# EasyEDA Pro project ProPrj_单相逆变电路.epro

# Schematic Schematic1
Board Name: Board1; Create Date: 2025-10-31; Page Name: P1; Project Name: 单相逆变电路; Schematic Name: Schematic1; Update Date: 2025-11-13; Company: 嘉立创EDA; Page Size: A4; Version: V1.0
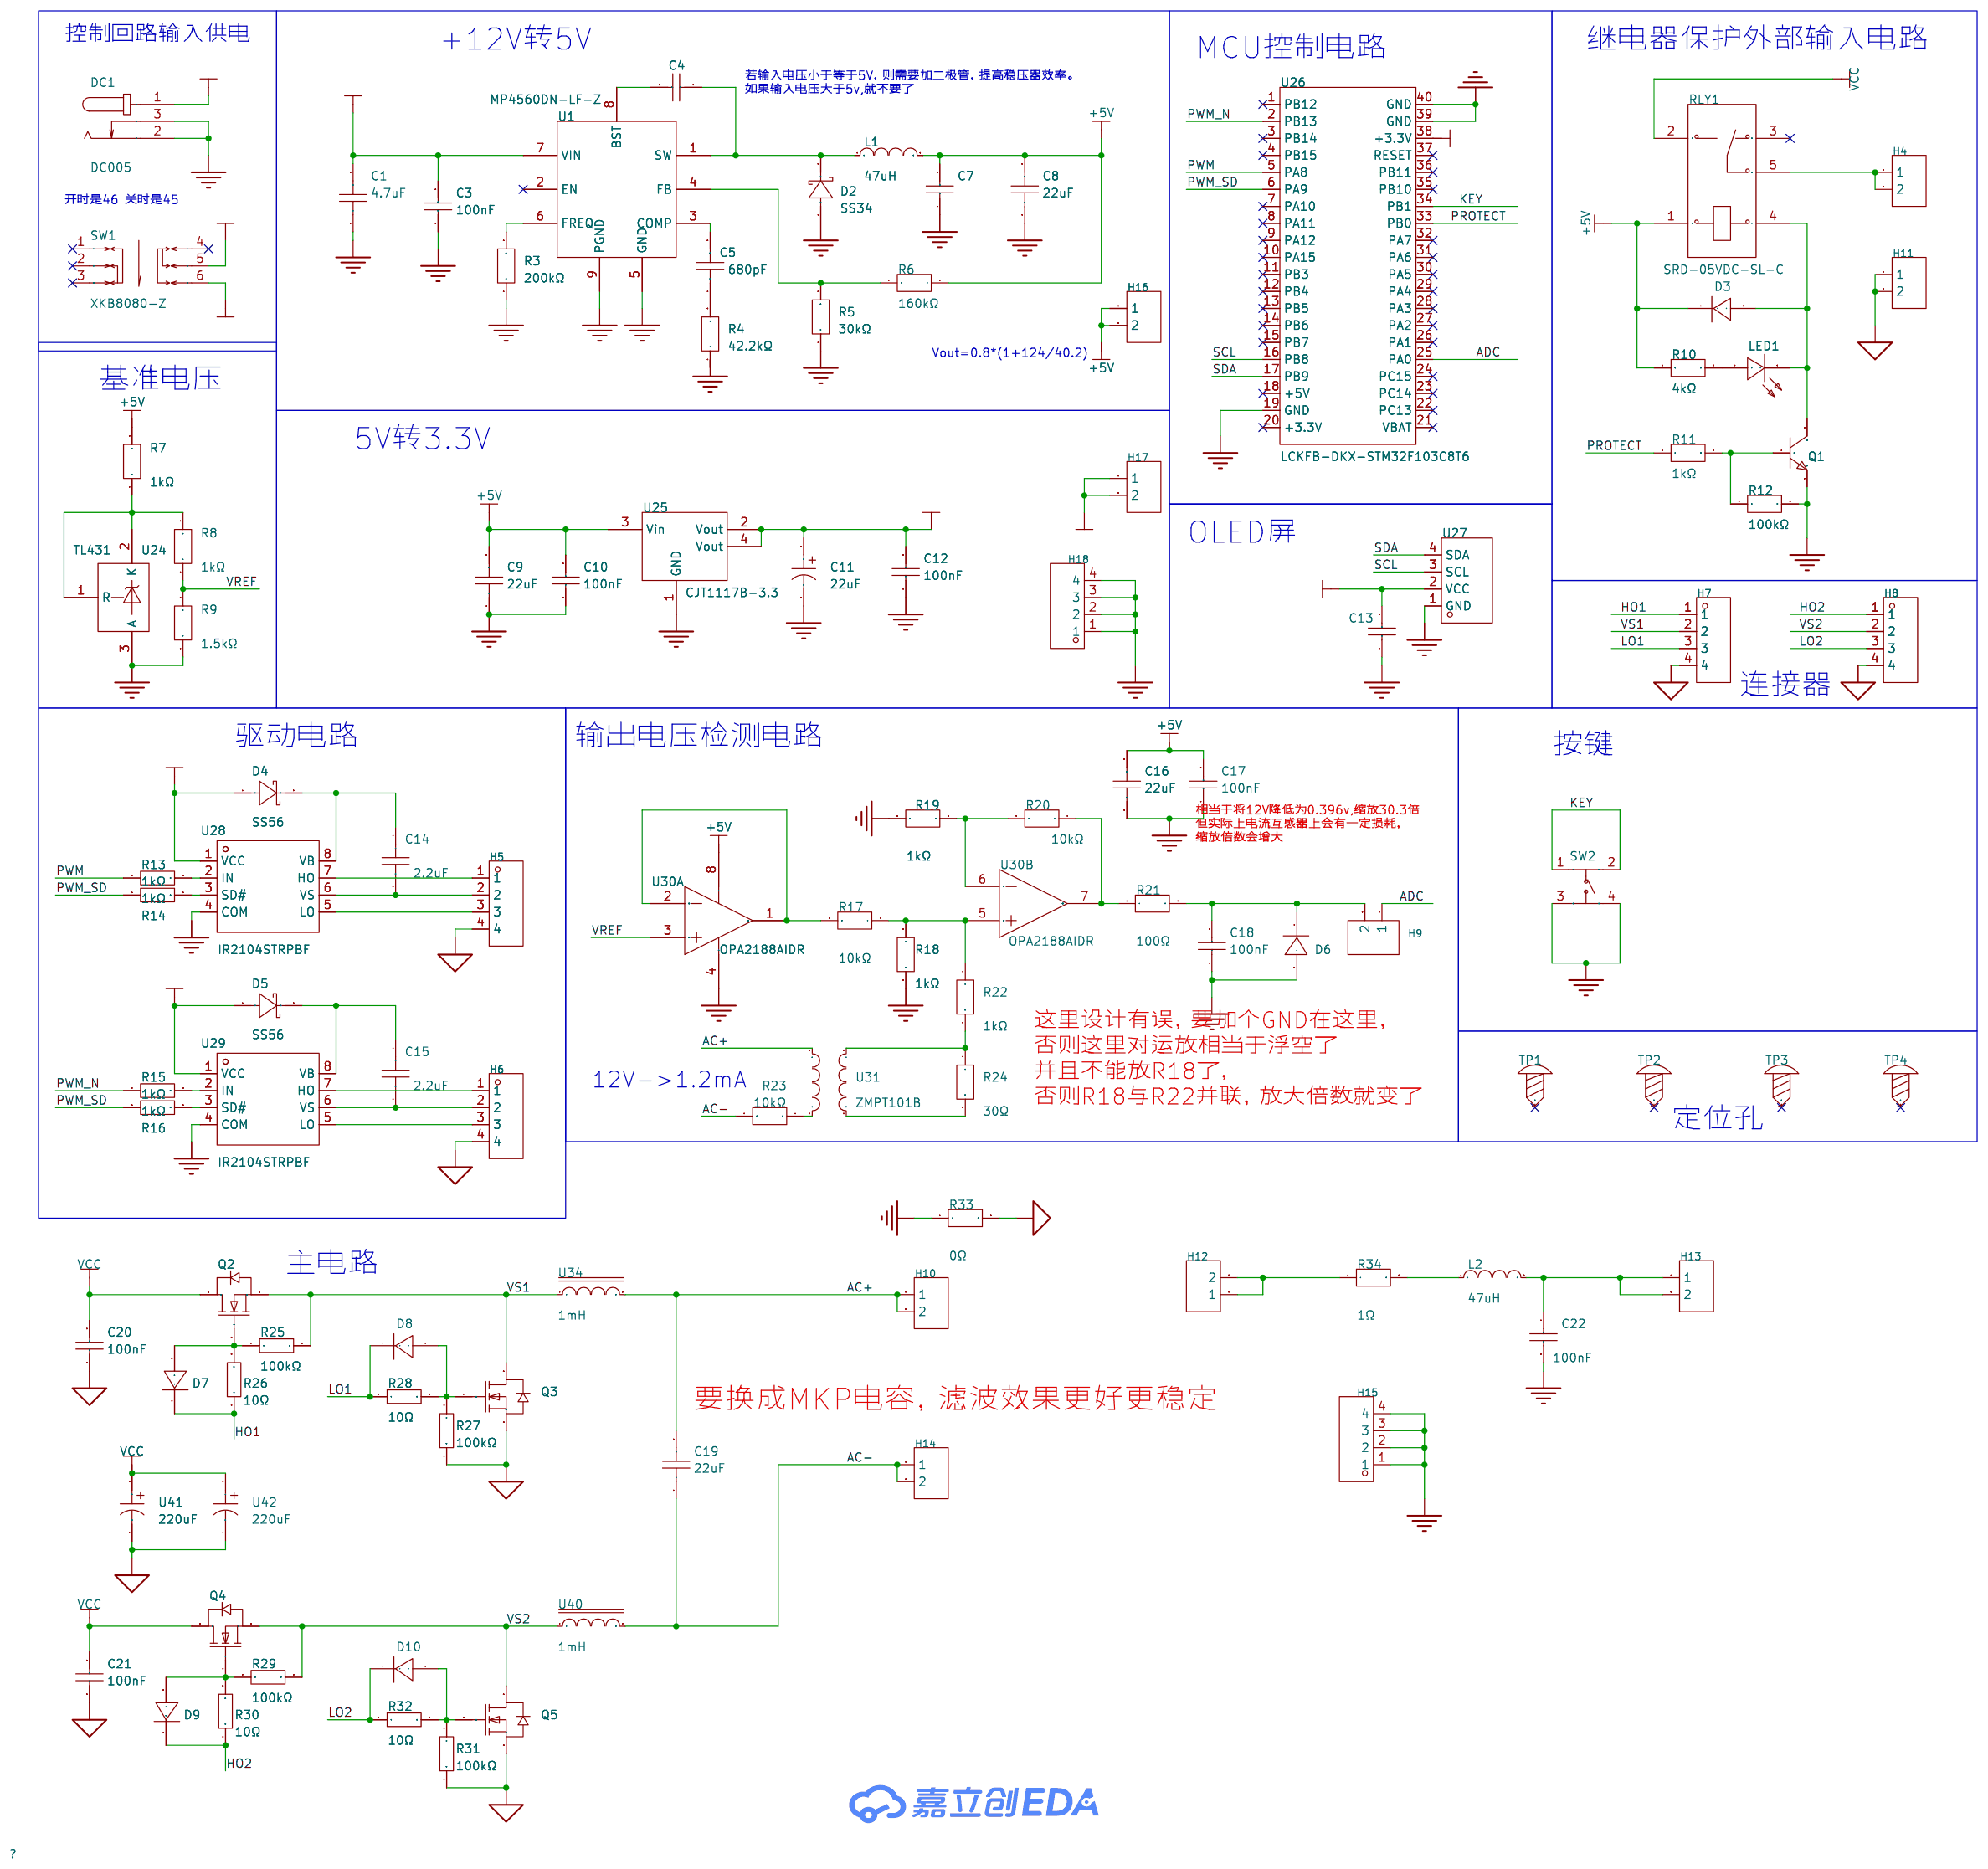
[diagram p0: schematic sheet]

## Parts
C1  4.7uF  [R1206]
C3  100nF  [C0805]
C4  100nF  [C0805]
C5  680pF  [R1206]
C7  100nF  [C0805]
C8  22uF  [C1206]
C9  22uF  [C1206]
C10  100nF  [C0805]
C11  22uF  [CAP-TH_BD6.0-P2.54-D0.5-FD]
C12  100nF  [C0805]
C13  100nF  [C0805]
C14  2.2uF  [C1206]
C15  2.2uF  [C1206]
C16  22uF  [C1206]
C17  100nF  [C0805]
C18  100nF  [C0805]
C19  22uF  [C1206]
C20  100nF  [C0805]
C21  100nF  [C0805]
C22  100nF  [C1206]
D2  SS34  [SMA_L4.3-W2.6-LS5.0-FD]
D3  1N4148W-E3-08  [SOD-123_L2.8-W1.8-LS3.7-RD]
D4  SS56  [SMA_L4.3-W2.6-LS5.0-FD]
D5  SS56  [SMA_L4.3-W2.6-LS5.0-FD]
D6  1N4148W-E3-08  [SOD-123_L2.8-W1.8-LS3.7-RD]
D7  1N4148W-E3-08  [SOD-123_L2.8-W1.8-LS3.7-RD]
D8  1N4148W-E3-08  [SOD-123_L2.8-W1.8-LS3.7-RD]
D9  1N4148W-E3-08  [SOD-123_L2.8-W1.8-LS3.7-RD]
D10  1N4148W-E3-08  [SOD-123_L2.8-W1.8-LS3.7-RD]
DC1  DC005  [DC-IN-TH_DC005]
H4  -  [HDR-TH_2P-P2.54-V-F]
H5  -  [HDR-TH_4P-P2.54-V-F]
H6  -  [HDR-TH_4P-P2.54-V-F]
H7  -  [HDR-TH_4P-P2.54-V-F]
H8  -  [HDR-TH_4P-P2.54-V-F]
H9  -  [HDR-TH_2P-P2.54-V-F]
H10  -  [HDR-TH_2P-P2.54-V-F]
H11  -  [HDR-TH_2P-P2.54-V-F]
H12  -  [HDR-TH_2P-P2.54-V-F]
H13  -  [HDR-TH_2P-P2.54-V-F]
H14  -  [HDR-TH_2P-P2.54-V-F]
H15  -  [HDR-TH_4P-P2.54-V-F]
H16  -  [HDR-TH_2P-P2.54-V-F]
H17  -  [HDR-TH_2P-P2.54-V-F]
H18  -  [HDR-TH_4P-P2.54-V-F]
L1  47uH  [IND-SMD_L7.0-W7.0_SMDRS70XX]
L2  47uH  [IND-SMD_L7.0-W7.0_SMDRS70XX]
LED1  NCD0805R1  [LED0805-R-RD]
Q1  MMS9013-H-TP  [SOT-23-3_L2.9-W1.3-P1.90-LS2.4-BR]
Q2  IRF3205ZPBF  [TO-220-3_L10.0-W4.5-P2.54-T]
Q3  IRF3205ZPBF  [TO-220-3_L10.0-W4.5-P2.54-T]
Q4  IRF3205ZPBF  [TO-220-3_L10.0-W4.5-P2.54-T]
Q5  IRF3205ZPBF  [TO-220-3_L10.0-W4.5-P2.54-T]
R3  200kΩ  [R1206]
R4  42.2kΩ  [R1206]
R5  30kΩ  [R1206]
R6  160kΩ  [R1206]
R7  1kΩ  [R1206]
R8  1kΩ  [R1206]
R9  1.5kΩ  [R1206]
R10  4kΩ  [R1206]
R11  1kΩ  [R1206]
R12  100kΩ  [R1206]
R13  1kΩ  [R1206]
R14  1kΩ  [R1206]
R15  1kΩ  [R1206]
R16  1kΩ  [R1206]
R17  10kΩ  [R1206]
R18  1kΩ  [R1206]
R19  1kΩ  [R1206]
R20  10kΩ  [R1206]
R21  100Ω  [R1206]
R22  1kΩ  [R1206]
R23  10kΩ  [R1206]
R24  30Ω  [R1206]
R25  100kΩ  [R1206]
R26  10Ω  [R1206]
R27  100kΩ  [R1206]
R28  10Ω  [R1206]
R29  100kΩ  [R1206]
R30  10Ω  [R1206]
R31  100kΩ  [R1206]
R32  10Ω  [R1206]
R33  0Ω  [R1206]
R34  1Ω  [R1206]
RLY1  SRD-05VDC-SL-C  [RELAY-TH_SRD-XXVDC-XL-C]
SW1  XKB8080-Z  [SW-TH_6P-L8.0-W8.0-P2.50]
SW2  TC-00104-050E  [SW-TH_4P-L6.0-W6.0-P4.50-LS6.5]
TP1  -  [M3螺丝]
TP2  -  [M3螺丝]
TP3  -  [M3螺丝]
TP4  -  [M3螺丝]
U1  MP4560DN-LF-Z  [SOIC-8_L4.9-W3.9-P1.27-LS6.0-BL-EP3.1-1]
U24  TL431  [SOT-23-3_L2.9-W1.4-P1.90-LS2.6-BR]
U25  CJT1117B-3.3  [SOT-223-4_L6.5-W3.5-P2.30-LS7.0-BR]
U26  LCKFB-DKX-STM32F103C8T6  [CONN-TH_L53.3-W22.9_STM32F103C8T6-CARD]
U27  HS96L03W2C03  [OLED-TH_L27.8-W27.2-P2.54_C9900033791]
U28  IR2104STRPBF  [SOIC-8_L4.9-W3.9-P1.27-LS6.0-BL]
U29  IR2104STRPBF  [SOIC-8_L4.9-W3.9-P1.27-LS6.0-BL]
U30  OPA2188AIDR  [SOIC-8_L4.9-W3.9-P1.27-LS6.0-BL]  (sections 1,2)
U31  ZMPT101B  [XFMR-TH_ZMPT101B]
U34  1mH  [IND-TH_L33.0-W15.6-P15.00-D1.5]
U40  1mH  [IND-TH_L33.0-W15.6-P15.00-D1.5]
U41  220uF  [CAP-TH_BD6.3-P2.50-D0.5-FD]
U42  220uF  [CAP-TH_BD6.3-P2.50-D0.5-FD]

## Library data of the parts
C1 = HHV1206R7475K101NSPJ: 容值:4.7uF;精度:±10%;额定电压:100V;温度系数:X7R;; LCSC Part Name: 4.7uF ±10% 100V; Supplier Part: C22367839; Manufacturer: Chinocera(华瓷); Supplier Footprint: 1206; JLCPCB Part Class: Extended Part; Datasheet: https://item.szlcsc.com/datasheet/HHV1206R7475K101NSPJ/23841144.html; Supplier: LCSC; Tolerance: ±10%; Voltage Rating: 100V; Temperature Coefficient: X7R
C3 C4 C7 C10 C12 C13 C17 C18 C20-C22 = CL21B104KCFNNNE: 容值:100nF;精度:±10%;额定电压:100V;温度系数:X7R;; LCSC Part Name: 100nF ±10% 100V; Supplier Part: C28233; Manufacturer: SAMSUNG(三星); Supplier Footprint: 0805; JLCPCB Part Class: Basic Part; Datasheet: https://item.szlcsc.com/datasheet/CL21B104KCFNNNE/28983.html; Supplier: LCSC; Tolerance: ±10%; Voltage Rating: 100V; Temperature Coefficient: X7R
C5 = HHV0805R7681K101NTHJ: 容值:680pF;精度:±10%;额定电压:100V;温度系数:X7R;; LCSC Part Name: 680pF ±10% 100V; Supplier Part: C5186814; Manufacturer: Chinocera(华瓷); Supplier Footprint: 0805; JLCPCB Part Class: Extended Part; Datasheet: https://item.szlcsc.com/datasheet/HHV0805R7681K101NTHJ/5857823.html; Supplier: LCSC; Tolerance: ±10%; Voltage Rating: 100V; Temperature Coefficient: X7R
C8 C9 C14-C16 C19 = CGA0805X5R226M350MT: 容值:22uF;精度:±20%;额定电压:35V;材质(温度系数):X5R;; LCSC Part Name: 22uF ±20% 35V; Supplier Part: C6119901; Manufacturer: HRE(芯声); Supplier Footprint: 0805; JLCPCB Part Class: Extended Part; Datasheet: https://atta.szlcsc.com/upload/public/pdf/source/20231129/D589D0CC4D260F7AC3A77E53B455CCB3.pdf; Supplier: LCSC; Tolerance: ±20%; Voltage Rated: 35V; Temperature Coefficient: X5R
C11 = 199D226X9025D1V1E3: 容值:22uF;精度:±10%;额定电压:25V;等效串联电阻(ESR):-;; LCSC Part Name: 22uF ±10% 25V; Supplier Part: C1651432; Manufacturer: VISHAY(威世); Supplier Footprint: 插件; JLCPCB Part Class: Extended Part; Datasheet: https://item.szlcsc.com/datasheet/199D226X9025D1V1E3/1742280.html; Supplier: LCSC; Tolerance: ±10%; Voltage Rating: 25V; Operating Temperature: -55℃~+125℃
D2 D4 D5 = SS34_C7420365: 二极管配置:独立式;正向压降(Vf):550mV@3.0A;直流反向耐压(Vr):40V;整流电流:3A;; LCSC Part Name: 40V 3A; Supplier Part: C7420365; Manufacturer: R+O(宏嘉诚); Supplier Footprint: SMA(DO-214AC); JLCPCB Part Class: Extended Part; Datasheet: https://item.szlcsc.com/datasheet/SS34/8397187.html; Supplier: LCSC; Diode Configuration: 独立式; Voltage - Forward(Vf@If): 550mV@3.0A; Voltage - DC Reverse(Vr): 40V; Current - Rectified: 3A; Reverse Leakage Current (Ir): 200uA@40V
D3 D6-D10 = 1N4148W-E3-08: 二极管配置:1个独立式;正向压降(Vf):1.2V@100mA;直流反向耐压(Vr):75V;整流电流:150mA;反向恢复时间(Trr):4ns;; Supplier Part: C241939; Manufacturer: VISHAY(威世); Supplier Footprint: SOD-123; JLCPCB Part Class: 扩展库; Datasheet: https://item.szlcsc.com/datasheet/1N4148W-E3-08/240783.html; Supplier: LCSC; Diode Configuration: 1个独立式; Voltage - Forward(Vf@If): 1.2V@100mA; Voltage - DC Reverse(Vr): 75V; Current - Rectified: 150mA; Pd - Power Dissipation: 350mW; Reverse Leakage Current (Ir): 100uA@100V; Reverse Recovery Time (trr): 4ns; Non-Repetitive Peak Forward Surge Current: 2A
DC1 = DC005: 连接器类型:DC电源插座;安装方式:弯插;触点内径:2mm;触点外径:6.3mm;额定电流:500mA;额定电压:30V;工作温度:-25℃~+70℃;; LCSC Part Name: DC电源插座 内径:2mm 外径:6.3mm; Supplier Part: C431533; Manufacturer: SHOU HAN(首韩); Supplier Footprint: 插件; JLCPCB Part Class: Extended Part; Datasheet: https://item.szlcsc.com/datasheet/DC005/427890.html; Supplier: LCSC; Connector Type: DC电源插座; Mounting Type: 弯插; Inside Contact Diameter: 2mm; Outside Contact Diameter: 6.3mm; Current Rating: 500mA; Voltage Rating (Max): 30V; Operating Temperature: -25℃~+70℃
H4 H9-H14 H16 H17 = HDR-F_2.54_1x2P: Supplier Part: C49661; Supplier Footprint: 插件
H5-H8 H15 H18 = HDR-F_2.54_1x4P: Supplier Part: C2718488; Supplier Footprint: 插件
L1 L2 = SLP7045S470MTT: 电感值:47uH;精度:±20%;额定电流:920mA;; LCSC Part Name: 47uH ±20%; Supplier Part: C254874; Manufacturer: Sunltech(顺磁); Supplier Footprint: SMD,7x7mm; JLCPCB Part Class: 扩展库; Datasheet: https://item.szlcsc.com/datasheet/SLP7045S470MTT/249199.html; Supplier: LCSC; Tolerance: ±20%; Current Rating: 920mA; DC Resistance(DCR): 125mΩ
LED1 = NCD0805R1: 灯头类型:-;发光颜色:红色;正向电压(VF):1.6V~2.6V;功率:65mW;正向电流:20mA;主波长:615nm~630nm;二极管配置:独立二极管;透镜颜色:无色透明透镜;色温:-;发光强度:67mcd~195mcd;发光角度:130°;载带方式:-;工作温度:-30℃~+85℃;; Supplier Part: C84256; Manufacturer: 国星光电; Supplier Footprint: 0805; JLCPCB Part Class: 基础库; Datasheet: https://atta.szlcsc.com/upload/public/pdf/source/20200820/C84256_F0A75A43B3EAD75808600A0514C76B99.pdf; Supplier: LCSC; Emitted Color: 红色; Forward Voltage (VF): 1.6V~2.6V; Power Dissipation: 65mW; Forward Current: 20mA; Dominant Wavelength: 615nm~630nm; Diode Configuration: 独立二极管; Lens Color: 无色透明透镜; Luminous Intensity: 67mcd~195mcd; Viewing Angle: 130°; Operating Temperature: -30℃~+85℃
Q1 = MMS9013-H-TP: 晶体管类型:NPN;集电极电流(Ic):500mA;集射极击穿电压(Vceo):25V;耗散功率(Pd):300mW;; LCSC Part Name: NPN 电流:500mA 电压:25V; Supplier Part: C90160; Manufacturer: MCC(美微科); Supplier Footprint: SOT-23; JLCPCB Part Class: 扩展库; Datasheet: https://item.szlcsc.com/datasheet/MMS9013-H-TP/91345.html; Supplier: LCSC; type: NPN; Current - Collector(Ic): 500mA; Collector - Emitter Voltage VCEO: 25V; Pd - Power Dissipation: 300mW
Q2-Q5 = IRF3205ZPBF: 类型:N沟道;漏源电压(Vdss):55V;连续漏极电流(Id):75A;功率(Pd):170W;导通电阻(RDS(on)@Vgs,Id):6.5mΩ@10V,66A;阈值电压(Vgs(th)@Id):4V@250uA;; LCSC Part Name: N沟道 耐压:55V 电流:75A; Supplier Part: C2612; Manufacturer: Infineon(英飞凌); Supplier Footprint: TO-220AB; JLCPCB Part Class: Extended Part; Datasheet: https://atta.szlcsc.com/upload/public/pdf/source/20170614/1497439891323.pdf; Supplier: LCSC; Type: N沟道; Drain Source Voltage (Vdss): 55V; Continuous Drain Current (Id): 75A; Power Dissipation (Pd): 170W; Drain Source On Resistance (RDS(on)@Vgs,Id): 6.5mΩ@10V,66A; Gate Threshold Voltage (Vgs(th)@Id): 4V@250uA; Total Gate Charge (Qg@Vgs): 110nC@10V; Input Capacitance (Ciss@Vds): 3.45nF@25V; Operating Temperature: -55℃~+175℃@(Tj)
R3 = FRC0805F2003TS: 电阻类型:厚膜电阻;阻值:200kΩ;精度:±1%;功率:125mW;工作电压:150V;温度系数:±100ppm/℃;; LCSC Part Name: 200kΩ ±1% 125mW 厚膜电阻; Supplier Part: C2907238; Manufacturer: FOJAN(富捷); Supplier Footprint: 0805; JLCPCB Part Class: Extended Part; Supplier: LCSC; Type: 厚膜电阻; Tolerance: ±1%; Power(Watts): 125mW; Voltage-Supply(Max): 150V; Temperature Coefficient: ±100ppm/℃; Operating Temperature: -55℃~+155℃
R4 = FRC0805F4222TS: 电阻类型:厚膜电阻;阻值:42.2kΩ;精度:±1%;功率:125mW;工作电压:150V;温度系数:±100ppm/℃;; LCSC Part Name: 42.2kΩ ±1% 125mW 厚膜电阻; Supplier Part: C2999591; Manufacturer: FOJAN(富捷); Supplier Footprint: 0805; JLCPCB Part Class: Extended Part; Supplier: LCSC; Type: 厚膜电阻; Tolerance: ±1%; Power(Watts): 125mW; Voltage-Supply(Max): 150V; Temperature Coefficient: ±100ppm/℃; Operating Temperature: -55℃~+155℃
R5 = FRC0805F4022TS: 电阻类型:厚膜电阻;阻值:40.2kΩ;精度:±1%;功率:125mW;工作电压:150V;温度系数:±100ppm/℃;; LCSC Part Name: 40.2kΩ ±1% 125mW 厚膜电阻; Supplier Part: C2933438; Manufacturer: FOJAN(富捷); Supplier Footprint: 0805; JLCPCB Part Class: Extended Part; Supplier: LCSC; Type: 厚膜电阻; Tolerance: ±1%; Power(Watts): 125mW; Voltage-Supply(Max): 150V; Temperature Coefficient: ±100ppm/℃; Operating Temperature: -55℃~+155℃
R6-R12 R17-R24 R33 R34 = FRC0805F1243TS: 电阻类型:厚膜电阻;阻值:124kΩ;精度:±1%;功率:125mW;工作电压:150V;温度系数:±100ppm/℃;; LCSC Part Name: 124kΩ ±1% 125mW 厚膜电阻; Supplier Part: C2933298; Manufacturer: FOJAN(富捷); Supplier Footprint: 0805; JLCPCB Part Class: Extended Part; Supplier: LCSC; Type: 厚膜电阻; Tolerance: ±1%; Power(Watts): 125mW; Voltage-Supply(Max): 150V; Temperature Coefficient: ±100ppm/℃; Operating Temperature: -55℃~+155℃
R13-R16 R25-R32 = 1206W4F1001T5E_C4410: 电阻类型:厚膜电阻;阻值:1kΩ;精度:±1%;功率:250mW;工作电压:200V;温度系数:±100ppm/℃;; LCSC Part Name: 1kΩ ±1% 250mW 厚膜电阻; Supplier Part: C4410; Manufacturer: UNI-ROYAL(厚声); Manufacturer Part: 1206W4F1001T5E; Supplier Footprint: 1206; JLCPCB Part Class: 基础库; Datasheet: https://item.szlcsc.com/datasheet/1206W4F1001T5E/4817.html; Supplier: LCSC; Type: 厚膜电阻; Tolerance: ±1%; Power(Watts): 250mW; Voltage-Supply(Max): 200V; Temperature Coefficient: ±100ppm/℃; Operating Temperature: -55℃~+155℃
RLY1 = SRD-05VDC-SL-C: 线圈电压:5V;触点形式:一组转换:1C(单刀双掷-转换);触点容量(电阻负载):-;最大切换电压:250V@AC;最大切换电流:15A;; LCSC Part Name: 蓝色 单组转换型继电器; Supplier Part: C35449; Manufacturer: 松乐; Supplier Footprint: 插件,15.6x19.2mm; JLCPCB Part Class: 扩展库; Datasheet: https://item.szlcsc.com/datasheet/SRD-05VDC-SL-C/36422.html; Supplier: LCSC; Coil Voltage: 5V; Contact Form: 一组转换:1C(单刀双掷-转换); Number of Pins: 5; Switching Voltage(Max): 250V@AC; Coil Rated Power: 360mW; Switching Current(Max): 15A; Coil Type: 无极性-单线圈; Coil Resistance: 70Ω; Contact Resistance: 100mΩ; Operate Time: 10ms; Release Time: 10ms
SW1 = XKB8080-Z: 自锁/无锁:自锁;安装方式:直插;触点电流:100mA;额定电压:30V;带灯:不带;作用力:1.6N;工作寿命:10万次;; LCSC Part Name: 8*8 蓝白黑 自锁开关; Supplier Part: C318860; Manufacturer: XKB Connection(中国星坤); Supplier Footprint: 插件; JLCPCB Part Class: 扩展库; Datasheet: https://item.szlcsc.com/datasheet/XKB8080-Z/299952.html; Supplier: LCSC; Self Lock / No Lock: 自锁; Actuator Style: 矩形按钮; Mounting Type: 直插; Contact Current: 100mA; Voltage Rating: 30V; Actuator/Cap Color: 蓝色; With Lamp: 不带; Termination Style: PC引脚; Operating Force: 1.6N; Operating Temperature: -15℃~+55℃; Life: 10万次
SW2 = TC-00104-050E: 电路结构:单刀单掷;按钮形状:圆形按钮;作用力:2.5N;开关长度:6mm;开关宽度:6mm;开关高度:5mm;带支架:不带支架;带灯:无;工作寿命:-;; LCSC Part Name: 轻触开关/6mm*6mm; Supplier Part: C2939600; Manufacturer: HOOYA(皓宇电子); Supplier Footprint: 插件,6x6mm; JLCPCB Part Class: 扩展库; Datasheet: https://item.szlcsc.com/datasheet/TC-00104-050E/3300585.html; Supplier: LCSC; Circuit: 单刀单掷; Actuator Style: 圆形按钮; Operating Force: 2.5N; Length: 6mm; Width: 6mm; Switch Height: 5mm; with Bracket: 不带支架; Actuator/Cap Color: 黑色; With Lamp: 无; Termination Style: PC引脚
TP1-TP4 = M3螺丝: Supplier Footprint: 插件
U1 = MP4560DN-LF-Z: 功能类型:降压型;输出类型:可调;工作电压:3.8V~55V;输出电压:800mV~52V;输出电流:2A;; LCSC Part Name: 2A, 2MHz, 55V降压转换器; Supplier Part: C40133; Manufacturer: MPS(芯源); Supplier Footprint: SOIC-8-EP; JLCPCB Part Class: Extended Part; Datasheet: https://item.szlcsc.com/datasheet/MP4560DN-LF-Z/41115.html; Supplier: LCSC; Function: 降压型; Output Type: 可调; Voltage - Supply: 3.8V~55V; Output Voltage: 800mV~52V; Output Current: 2A; Frequency - Switching: 1MHz；2MHz; Operating Temperature: -40℃~+125℃@(TJ); Synchronous Rectifier: 否; Number of Outputs: 1; Topology: 降压式; Quiescent Current: 140uA; Switch tube (built-in/external): 内置
U24 = TL431_C963380: 输出类型:可调;输入电压:37V;输出电压:2.5V~36V;输出电流:-;精度:-;; Supplier Part: C963380; Manufacturer: JSMSEMI(杰盛微); Supplier Footprint: SOT-23; JLCPCB Part Class: 扩展库; Datasheet: https://atta.szlcsc.com/upload/public/pdf/source/20230807/EF0970E00E6F0FAFB24359B08B49660E.pdf; Supplier: LCSC; Output Type: 可调; Input Voltage: 37V; Output Voltage: 2.5V~36V; Temperature Coefficient: 50ppm/℃; Reference Type: 并联; Minimum Cathode Current for Regulation: 1mA; Dynamic Impedance: 150mΩ; Operating Temperature: -25℃~+85℃
U25 = CJT1117B-3.3: 输出类型:固定;工作电压:15V;输出电压:3.3V;输出电流:1A;电源纹波抑制比(PSRR):75dB@(120Hz);输出极性:正极;; LCSC Part Name: 输入15V 输出3.3V 1A; Supplier Part: C78777; Manufacturer: CJ(江苏长电/长晶); Supplier Footprint: SOT-223; JLCPCB Part Class: 扩展库; Datasheet: https://item.szlcsc.com/datasheet/CJT1117B-3.3/79914.html; Supplier: LCSC; Output Type: 固定; Voltage - Supply: 15V; Output Voltage: 3.3V; Output Current: 1A; Power Supply Rejection Ratio (PSRR): 75dB@(120Hz); Voltage Dropout: 1.3V; standby current: 10mA; Noise: 0.003%Vout; Features: 短路保护；过热保护；过流保护; Operating Temperature: -40℃~+125℃@(Tj); Output Configuration: 正极; Number of Outputs: 1
U26 = LCKFB-DKX-STM32F103C8T6: LCSC Part Name: 立创·地阔星-STM32F103C8T6开发板; Supplier Part: C22396880; Manufacturer: 立创开发板; JLCPCB Part Class: 扩展库; Datasheet: https://item.szlcsc.com/datasheet/LCKFB-DKX-STM32F103C8T6/24005615.html; Supplier: LCSC
U27 = HS96L03W2C03: 主控芯片:SSD1315;接口类型:I2C;尺寸(inch):0.96;像素分辨率:128x64;; LCSC Part Name: 0.96寸OLED显示屏窄白光IIC; Supplier Part: C5248080; Manufacturer: HS(汉昇); JLCPCB Part Class: 扩展库; Datasheet: https://atta.szlcsc.com/upload/public/pdf/source/20230627/763D01F79A90007632F098068C7C8AD9.pdf; Supplier: LCSC; Main Control Chip: SSD1315; Interface Type: I2C; Size: 0.96; Pixel Resolution: 128x64; Operating Temperature: -40℃~+70℃
U28 U29 = IR2104STRPBF: 驱动配置:半桥;负载类型:IGBT；MOSFET;驱动通道数:2;灌电流(IOL):270mA;拉电流(IOH):130mA;工作电压:10V~20V;上升时间(tr):100ns;下降时间(tf):50ns;; LCSC Part Name: 半桥驱动器; Supplier Part: C2960; Manufacturer: Infineon(英飞凌); Supplier Footprint: SOIC-8; JLCPCB Part Class: 扩展库; Datasheet: https://item.szlcsc.com/datasheet/IR2104STRPBF/3342.html; Supplier: LCSC; Driven Configuration: 半桥; Load Type: IGBT；MOSFET; Number of Drivers: 2; Current - Output Low(IOL): 270mA; Current - Output High(IOH): 130mA; Voltage - Supply: 10V~20V; Rise Time: 100ns; Fall Time: 50ns; Propagation Delay tpLH: 680ns; Propagation Delay tpHL: 150ns; Features: 欠压保护(UVP); Operating Temperature: -40℃~+150℃@(Tj); Quiescent Current(Iq): 150uA
U30 = OPA2188AIDR: 放大器数:双路;增益带宽积(GBP):2MHz;输入偏置电流(Ib):160pA;输入失调电压(Vos):6uV;压摆率(SR):0.8V/us;轨到轨:轨到轨输出;; LCSC Part Name: OPA2188AIDR  零漂移; Supplier Part: C17271; Manufacturer: TI(德州仪器); Supplier Footprint: SOIC-8; JLCPCB Part Class: 扩展库; Datasheet: https://www.ti.com/cn/lit/gpn/opa2188; Supplier: LCSC; Number of Channels: 双路; Gain Bandwidth Product: 2MHz; Ib - Input Bias Current: 160pA; Vos - Input Offset Voltage: 6uV; Common Mode Rejection Ratio(CMRR): 146dB; Slew Rate: 0.8V/us; Output Current: 18mA; Rail to Rail: 轨到轨输出; Quiescent Current(Iq): 475uA; Operating Temperature: -40℃~+105℃; Single Supply: 4V~36V; Dual Supply: -18V~-2V；2V~18V; Maximum Power Supply Range (Vdd-Vss): 36V; Noise density(eN): 8.8nV/√Hz@1kHz; Input Offset Current(Ios): 320pA
U31 = ZMPT101B: 匝数比:-;额定输入电流:-;次级侧电感值:-;; Supplier Part: C111858; Manufacturer: 择明朗熙; Supplier Footprint: 插件; JLCPCB Part Class: 扩展库; Datasheet: https://item.szlcsc.com/datasheet/ZMPT101B/113087.html; Supplier: LCSC
U34 U40 = XR106125TS470MV1L5: 电感值:47uH;精度:±10%;额定电流:12A;类型:磁环电感;; LCSC Part Name: 47uH ±10% 磁环电感; Supplier Part: C22358529; Manufacturer: XR(祥如); Supplier Footprint: 插件,33x15.6mm; JLCPCB Part Class: 扩展库; Datasheet: https://atta.szlcsc.com/upload/public/pdf/source/20240313/975BD6823DE6C304357683F4CE864895.pdf; Supplier: LCSC; Tolerance: ±10%; Rated Current: 12A; Type: 磁环电感; Wire Diameter: 1.5mm
U41 U42 = KM1E221M0611: 容值:220uF;精度:±20%;额定电压:25V;纹波电流:236mA@120kHz;等效串联电阻(ESR):-;; LCSC Part Name: 220uF ±20% 25V; Supplier Part: C2873972; Manufacturer: ROQANG(容强); Supplier Footprint: 插件; JLCPCB Part Class: 扩展库; Datasheet: https://atta.szlcsc.com/upload/public/pdf/source/20210825/43CC5C3A3C9845108B639C21E16A1224.pdf; Supplier: LCSC; Tolerance: ±20%; Voltage Rating: 25V; Ripple Current: 236mA@120kHz; Pin Spacing: 2.5mm; Lifetime: 2000hrs@105℃; Operating Temperature: -40℃~+105℃

## Nets
+3.3V: C11.1 C12.2 C13.2 H17.1 H17.2 U25.2(Vout) U25.4(Vout) U26.38(+3.3V) U27.2(VCC)
+5V: C7.2 C8.2 C9.2 C10.2 C16.2 C17.2 D3.1(K) H16.1 H16.2 L1.2 R6.2 R7.2 R10.1 RLY1.1 U25.3(Vin) U30.8(V+)
+12V: C1.2 C3.2 D4.1(A) D5.1(A) SW1.5 U1.7(VIN) U28.1(VCC) U29.1(VCC)
AGND: C20.1 C21.1 H5.4 H6.4 H7.4 H8.4 H11.1 H11.2 Q3.3(S) Q5.3(S) R27.2 R31.2 R33.2 U41.2 U42.2
GND: C1.1 C3.1 C7.1 C8.1 C9.1 C10.1 C11.2 C12.1 C13.1 C16.1 C17.1 C18.1 C22.2 D2.1(A) D6.2(A) DC1.2 DC1.3 H15.1 H15.2 H15.3 H15.4 H18.1 H18.2 H18.3 H18.4 Q1.2(E) R3.1 R4.1 R5.1 R9.1 R12.2 R18.2 R19.1 R33.1 SW2.3(C) SW2.4(D) U1.5(GND) U1.9(PGND) U24.3(A) U25.1(GND) U26.19(GND) U26.39(GND) U26.40(GND) U27.1(GND) U28.4(COM) U29.4(COM) U30.4(V-)
VCC: C20.2 C21.2 Q2.2(D) Q4.2(D) RLY1.2 U41.1 U42.1
VIN: DC1.1 SW1.6
AC+: C19.2 H10.1 H10.2 U31.1 U34.2
AC-: C19.1 H14.1 H14.2 R23.2 U40.2
ADC: H9.1 U26.25(PA0)
HO1: D7.1(K) H7.1 R26.1
HO2: D9.1(K) H8.1 R30.1
KEY: SW2.1(A) SW2.2(B) U26.34(PB1)
LO1: D8.1(K) H7.3 R28.1
LO2: D10.1(K) H8.3 R32.1
PROTECT: R11.1 U26.33(PB0)
PWM: R13.1 U26.5(PA8)
PWM_N: R15.1 U26.2(PB13)
PWM_SD: R14.1 R16.1 U26.6(PA9)
SCL: U26.16(PB8) U27.3(SCL)
SDA: U26.17(PB9) U27.4(SDA)
VREF: R8.1 R9.2 U30.3(IN A+)
VS1: H7.2 Q2.3(S) Q3.2(D) R25.2 U34.1
VS2: H8.2 Q4.3(S) Q5.2(D) R29.2 U40.1
$1N1140: R3.2 U1.6(FREQ)
$1N1144: C4.1 U1.8(BST)
$1N1145: C4.2 D2.2(K) L1.1 U1.1(SW)
$1N1147: C5.2 U1.3(COMP)
$1N1148: C5.1 R4.2
$1N1149: R5.2 R6.1 U1.4(FB)
$1N3535: D3.2(A) LED1.2(-) Q1.3(C) RLY1.4
$1N3675: LED1.1(+) R10.2
$1N3825: Q1.1(B) R11.2 R12.1
$1N3941: H4.1 H4.2 RLY1.5
$1N4743: R13.2 U28.2(IN)
$1N4782: R14.2 U28.3(SD#)
$1N5050: C14.2 H5.2 U28.6(VS)
$1N5056: H5.1 U28.7(HO)
$1N5061: H5.3 U28.5(LO)
$1N5066: C14.1 D4.2(K) U28.8(VB)
$1N5482: R15.2 U29.2(IN)
$1N5484: R16.2 U29.3(SD#)
$1N5486: C15.2 H6.2 U29.6(VS)
$1N5489: H6.1 U29.7(HO)
$1N5491: H6.3 U29.5(LO)
$1N5493: C15.1 D5.2(K) U29.8(VB)
$1N7479: R17.2 U30.1(OUT A) U30.2(IN A-)
$1N7713: R19.2 R20.2 U30.6(IN B-)
$1N7818: C18.2 D6.1(K) H9.2 R21.2
$1N7823: R20.1 R21.1 U30.7(OUT B)
$1N8024: R17.1 R18.1 R22.1 U30.5(IN B+)
$1N8226: R24.2 U31.3
$1N8230: R22.2 R24.1 U31.4
$1N9075: D7.2(A) Q2.1(G) R25.1 R26.2
$1N9356: D8.2(A) Q3.1(G) R27.1 R28.2
$1N9734: D9.2(A) Q4.1(G) R29.1 R30.2
$1N9747: D10.2(A) Q5.1(G) R31.1 R32.2
$1N10759: H12.1 H12.2 R34.1
$1N10764: L2.1 R34.2
$1N10806: C22.1 H13.1 H13.2 L2.2
$1N11007: R7.1 R8.2 U24.1(R) U24.2(K)
$1N16706: R23.1 U31.2

Not connected (* = marked no-connect by the designer): RLY1 3*; SW1 1* 2* 3* 4*; TP1 1*; TP2 1*; TP3 1*; TP4 1*; U1 2(EN)*; U26 1(PB12)* 3(PB14)* 4(PB15)* 7(PA10)* 8(PA11)* 9(PA12)* 10(PA15)* 11(PB3)* 12(PB4)* 13(PB5)* 14(PB6)* 15(PB7)* 18(+5V)* 20(+3.3V)* 21(VBAT)* 22(PC13)* 23(PC14)* 24(PC15)* 26(PA1)* 27(PA2)* 28(PA3)* 29(PA4)* 30(PA5)* 31(PA6)* 32(PA7)* 35(PB10)* 36(PB11)* 37(RESET)*

## Notes on the sheet
- 控制回路输入供电
- +12V转5V
- 继电器保护外部输入电路
- MCU控制电路
- 若输入电压小于等于5V，则需要加二极管，提高稳压器效率。
  如果输入电压大于5v,就不要了
- 开时是46 关时是45
- Vout=0.8*(1+124/40.2)
- 基准电压
- 5V转3.3V
- OLED屏
- 连接器
- 驱动电路
- 输出电压检测电路
- 按键
- 相当于将12V降低为0.396v,缩放30.3倍
  但实际上电流互感器上会有一定损耗，
  缩放倍数会增大
- 这里设计有误，要加个GND在这里，
  否则这里对运放相当于浮空了
- 12V->1.2mA
- 并且不能放R18了，
  否则R18与R22并联，放大倍数就变了
- 定位孔
- 主电路
- 要换成MKP电容，滤波效果更好更稳定

# Board PCB1
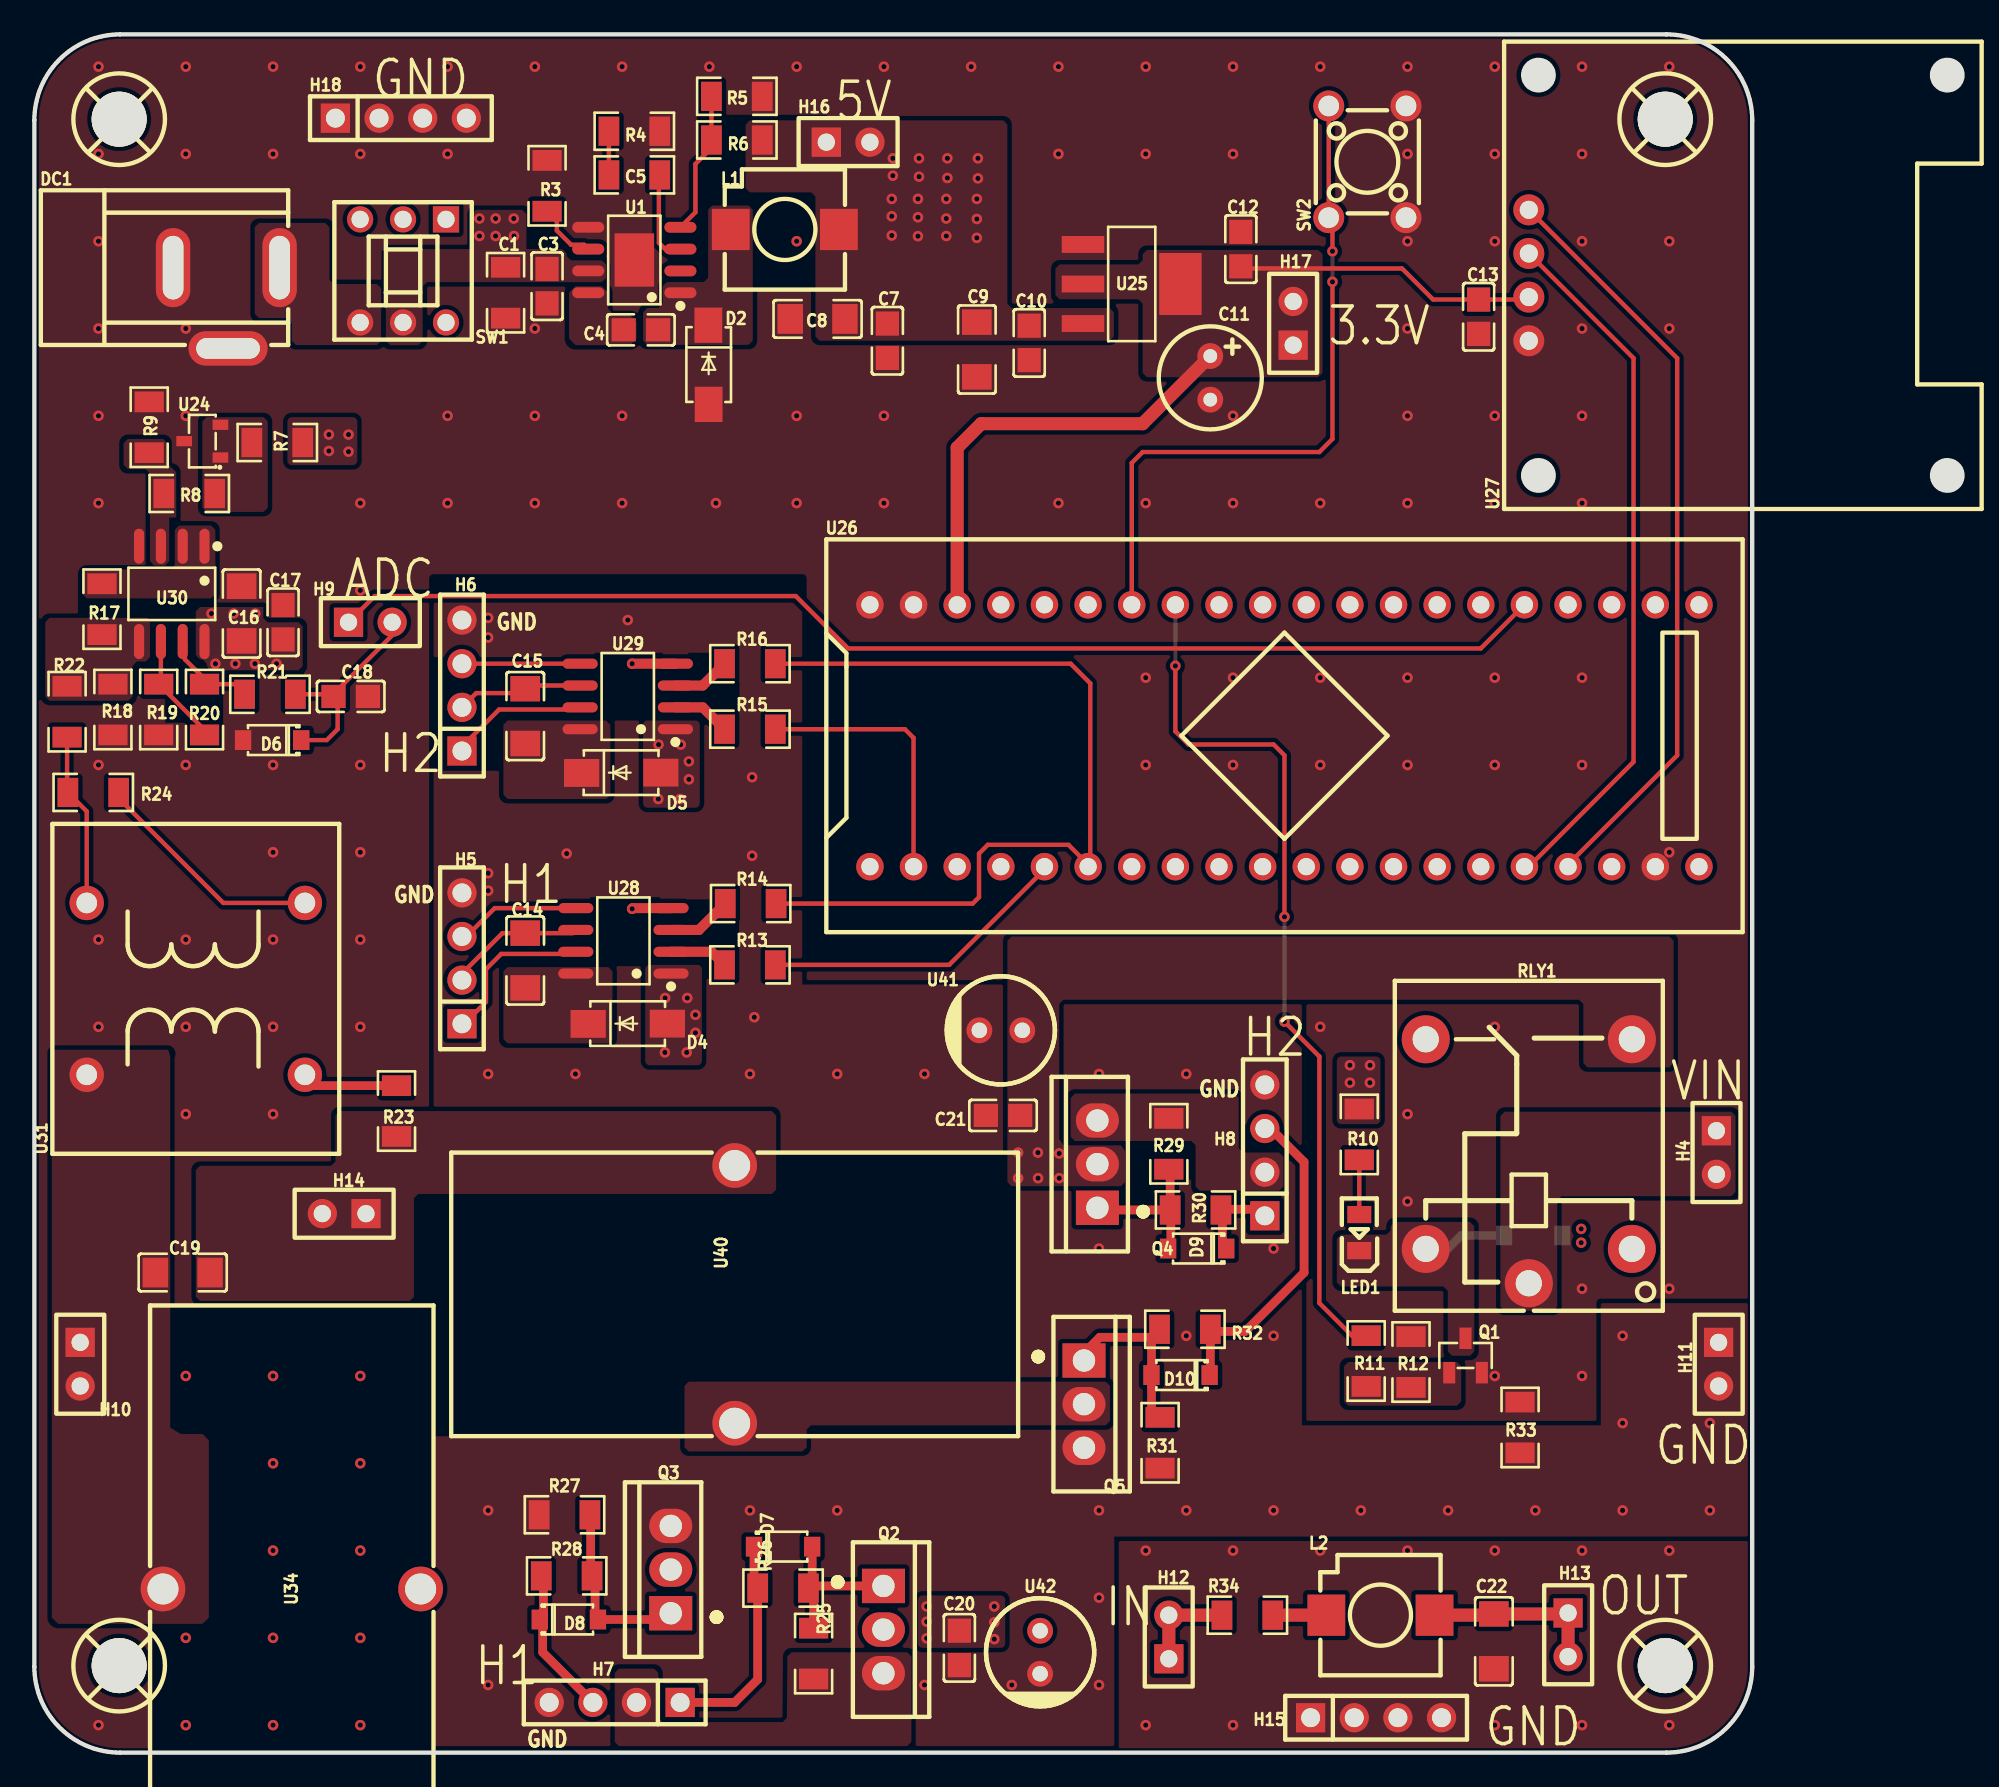
[diagram p1: board, top side]
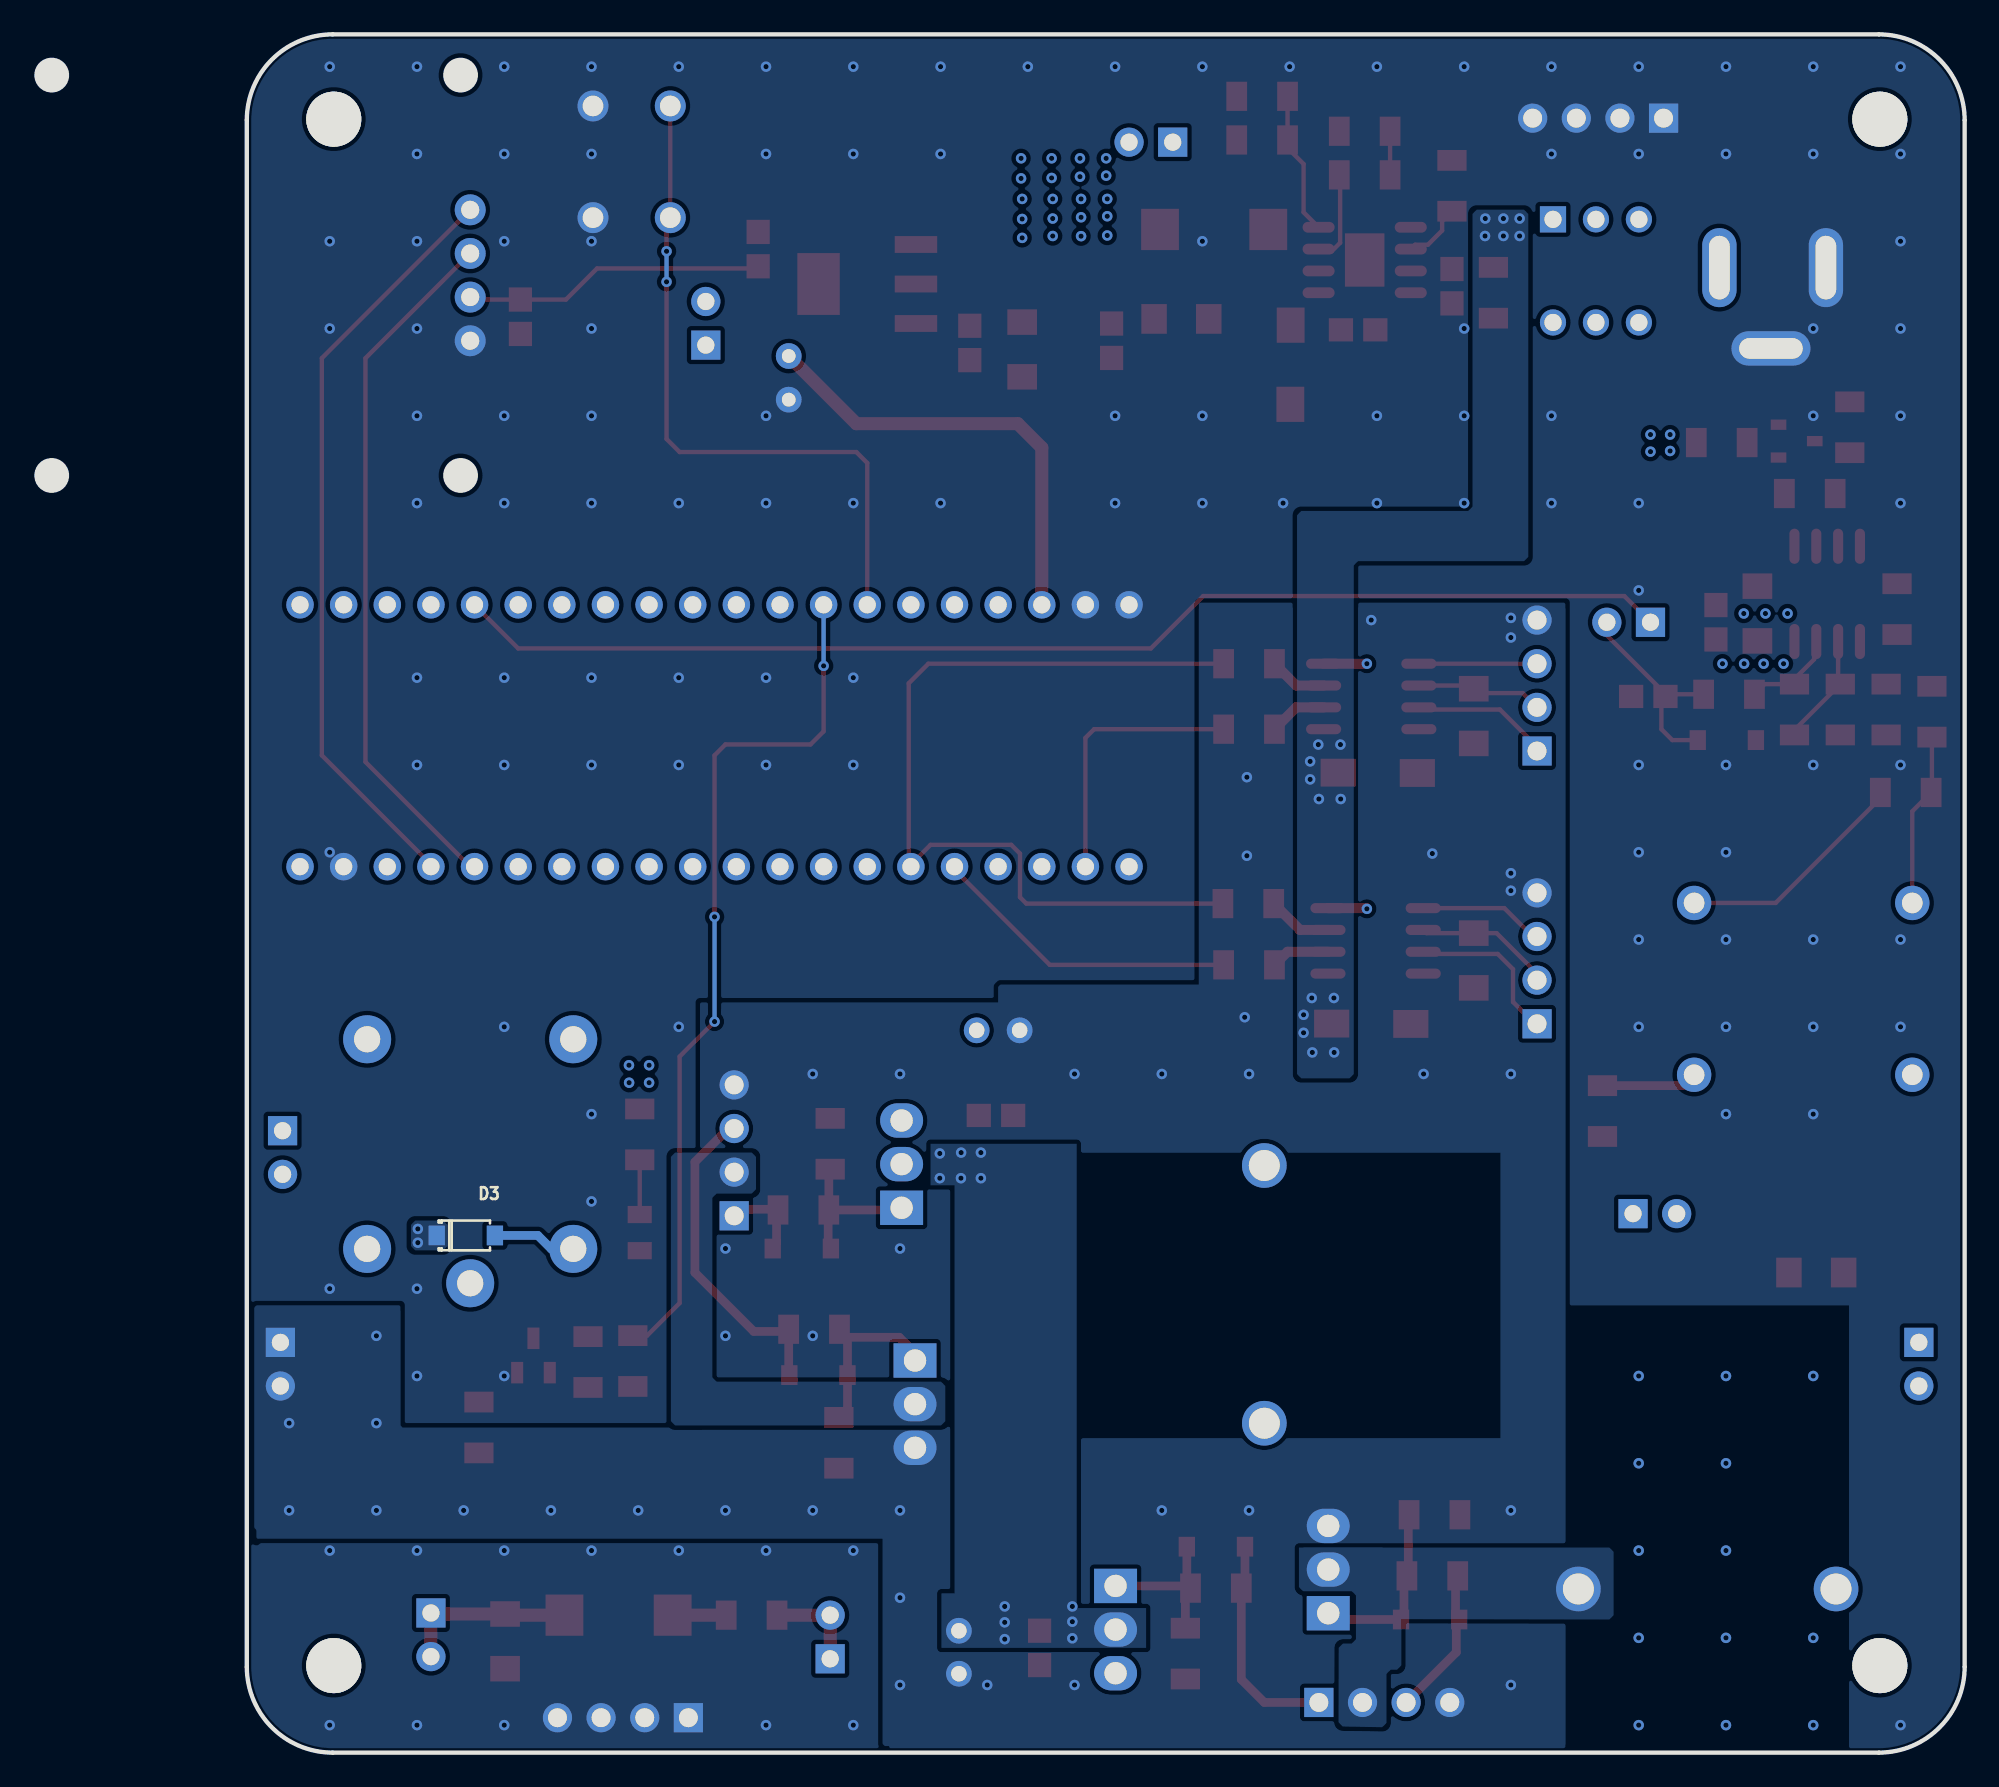
[diagram p2: board, bottom side, seen from below]

Outline 112.37 x 100 mm; copper layers: Top Layer, Inner1, Inner2, Bottom Layer. Coordinates in mm from the lower left corner of the outline.
Outline path: 0,95 0,5 arc(1.46,1.46) 5,0 95,0 arc(98.54,1.46) 100,5 100,95 arc(98.54,98.54) 95,100 5,100 arc(1.46,98.54) 0,95
Stack: Top Layer 0.035mm 外层铜厚1oz / Dielectric1 0.2104mm 7628 RC49% 8.6mil / Inner1 0.0152mm 内层铜厚 / Dielectric2 1.065mm 1.1mm H/HOZ Copper / Inner2 0.0152mm 内层铜厚 / Dielectric3 0.2104mm 7628 RC49% 8.6mil / Bottom Layer 0.035mm 外层铜厚1oz

## Design rules (mm)
template: 自定义配置
spacing copperThickness1oz (default): track to track 0.102, other pairs 0.152 to 0.3
spacing copperThickness2oz: track to track 0.203, other pairs 0.152 to 0.3
track width copperThickness1oz (default): min 0.127, default 0.254, max 2.54
track width copperThickness2oz: min 0.203, default 0.254, max 2.54
differential pair differentialPair (default): width min 0.127, default 0.254, max 2.54; gap min 0.152, default 0.152
via viaSize (default): diameter min 0.5, default 0.61, max 10; hole min 0.3, default 0.305, max 6.3

## Placement (name value [footprint] x y rotation side)
C1  4.7uF  [R1206]  27.43 84.96 90 top
C3  100nF  [C0805]  29.84 85.34 90 top
C4  100nF  [C0805]  35.31 82.8 0 top
C5  680pF  [R1206]  34.92 91.82 0 top
C7  100nF  [C0805]  49.66 82.17 90 top
C8  22uF  [C1206]  45.59 83.44 0 top
C9  22uF  [C1206]  54.86 81.66 90 top
C10  100nF  [C0805]  57.91 82.04 90 top
C11  22uF  [CAP-TH_BD6.0-P2.54-D0.5-FD]  68.45 80.01 270 top
C12  100nF  [C0805]  70.23 87.5 270 top
C13  100nF  [C0805]  84.07 83.57 90 top
C14  2.2uF  [C1206]  28.58 46.1 90 top
C15  2.2uF  [C1206]  28.58 60.33 90 top
C16  22uF  [C1206]  12.06 66.29 270 top
C17  100nF  [C0805]  14.48 65.79 270 top
C18  100nF  [C0805]  18.42 61.47 180 top
C19  22uF  [C1206]  8.64 27.94 180 top
C20  100nF  [C0805]  53.85 6.1 90 top
C21  100nF  [C0805]  56.39 37.08 0 top
C22  100nF  [C1206]  84.96 6.48 270 top
D2  SS34  [SMA_L4.3-W2.6-LS5.0-FD]  39.24 80.77 90 top
D3  1N4148W-E3-08  [SOD-123_L2.8-W1.8-LS3.7-RD]  87.25 30.1 180 bottom
D4  SS56  [SMA_L4.3-W2.6-LS5.0-FD]  34.54 42.42 180 top
D5  SS56  [SMA_L4.3-W2.6-LS5.0-FD]  34.16 57.02 180 top
D6  1N4148W-E3-08  [SOD-123_L2.8-W1.8-LS3.7-RD]  13.84 58.93 180 top
D7  1N4148W-E3-08  [SOD-123_L2.8-W1.8-LS3.7-RD]  43.59 11.99 0 top
D8  1N4148W-E3-08  [SOD-123_L2.8-W1.8-LS3.7-RD]  31.11 7.75 0 top
D9  1N4148W-E3-08  [SOD-123_L2.8-W1.8-LS3.7-RD]  67.69 29.34 180 top
D10  1N4148W-E3-08  [SOD-123_L2.8-W1.8-LS3.7-RD]  66.72 21.97 180 top
DC1  DC005  [DC-IN-TH_DC005]  11.18 84.07 0 top
H4  -  [HDR-TH_2P-P2.54-V-F]  97.92 34.92 270 top
H5  -  [HDR-TH_4P-P2.54-V-F]  24.89 46.23 90 top
H6  -  [HDR-TH_4P-P2.54-V-F]  24.89 62.1 90 top
H7  -  [HDR-TH_4P-P2.54-V-F]  33.78 2.92 180 top
H8  -  [HDR-TH_4P-P2.54-V-F]  71.63 35.05 90 top
H9  -  [HDR-TH_2P-P2.54-V-F]  19.56 65.79 0 top
H10  -  [HDR-TH_2P-P2.54-V-F]  2.67 22.61 270 top
H11  -  [HDR-TH_2P-P2.54-V-F]  98.04 22.61 270 top
H12  -  [HDR-TH_2P-P2.54-V-F]  66.04 6.73 90 top
H13  -  [HDR-TH_2P-P2.54-V-F]  89.28 6.86 270 top
H14  -  [HDR-TH_2P-P2.54-V-F]  18.03 31.37 180 top
H15  -  [HDR-TH_4P-P2.54-V-F]  78.1 2.03 0 top
H16  -  [HDR-TH_2P-P2.54-V-F]  47.37 93.73 0 top
H17  -  [HDR-TH_2P-P2.54-V-F]  73.28 83.19 90 top
H18  -  [HDR-TH_4P-P2.54-V-F]  21.34 95.12 0 top
L1  47uH  [IND-SMD_L7.0-W7.0_SMDRS70XX]  43.69 88.65 0 top
L2  47uH  [IND-SMD_L7.0-W7.0_SMDRS70XX]  78.36 8 0 top
LED1  NCD0805R1  [LED0805-R-RD]  77.13 30.26 90 top
Q1  MMS9013-H-TP  [SOT-23-3_L2.9-W1.3-P1.90-LS2.4-BR]  83.31 23.11 270 top
Q2  IRF3205ZPBF  [TO-220-3_L10.0-W4.5-P2.54-T]  49.43 7.16 0 top
Q3  IRF3205ZPBF  [TO-220-3_L10.0-W4.5-P2.54-T]  37.05 10.65 180 top
Q4  IRF3205ZPBF  [TO-220-3_L10.0-W4.5-P2.54-T]  61.88 34.25 180 top
Q5  IRF3205ZPBF  [TO-220-3_L10.0-W4.5-P2.54-T]  61.1 20.28 0 top
R3  200kΩ  [R1206]  29.84 91.19 270 top
R4  42.2kΩ  [R1206]  34.92 94.36 180 top
R5  30kΩ  [R1206]  40.89 96.39 180 top
R6  160kΩ  [R1206]  40.89 93.85 0 top
R7  1kΩ  [R1206]  14.14 76.25 0 top
R8  1kΩ  [R1206]  9.02 73.28 0 top
R9  1.5kΩ  [R1206]  6.69 77.13 270 top
R10  4kΩ  [R1206]  77.13 35.98 270 top
R11  1kΩ  [R1206]  77.53 22.79 270 top
R12  100kΩ  [R1206]  80.14 22.73 90 top
R13  1kΩ  [R1206]  41.66 45.85 180 top
R14  1kΩ  [R1206]  41.7 49.41 180 top
R15  1kΩ  [R1206]  41.66 59.56 180 top
R16  1kΩ  [R1206]  41.66 63.37 180 top
R17  10kΩ  [R1206]  3.94 66.55 90 top
R18  1kΩ  [R1206]  4.57 60.71 270 top
R19  1kΩ  [R1206]  7.24 60.71 90 top
R20  10kΩ  [R1206]  9.91 60.71 270 top
R21  100Ω  [R1206]  13.72 61.59 0 top
R22  1kΩ  [R1206]  1.91 60.58 270 top
R23  10kΩ  [R1206]  21.08 37.34 270 top
R24  30Ω  [R1206]  3.43 55.88 0 top
R25  100kΩ  [R1206]  45.36 5.76 270 top
R26  10Ω  [R1206]  43.59 9.57 0 top
R27  100kΩ  [R1206]  30.86 13.84 180 top
R28  10Ω  [R1206]  30.99 10.29 0 top
R29  100kΩ  [R1206]  66.04 35.43 90 top
R30  10Ω  [R1206]  67.6 31.58 180 top
R31  100kΩ  [R1206]  65.53 18.03 270 top
R32  10Ω  [R1206]  66.98 24.64 180 top
R33  0Ω  [R1206]  86.49 18.92 270 top
R34  1Ω  [R1206]  70.61 8 0 top
RLY1  SRD-05VDC-SL-C  [RELAY-TH_SRD-XXVDC-XL-C]  87 34.42 90 top
SW1  XKB8080-Z  [SW-TH_6P-L8.0-W8.0-P2.50]  21.46 86.23 180 top
SW2  TC-00104-050E  [SW-TH_4P-L6.0-W6.0-P4.50-LS6.5]  77.6 92.58 90 top
TP1  -  [M3螺丝]  5 5 0 top
TP2  -  [M3螺丝]  95 5 0 top
TP3  -  [M3螺丝]  5 95 0 top
TP4  -  [M3螺丝]  95 95 0 top
U1  MP4560DN-LF-Z  [SOIC-8_L4.9-W3.9-P1.27-LS6.0-BL-EP3.1-1]  34.92 86.87 90 top
U24  TL431  [SOT-23-3_L2.9-W1.4-P1.90-LS2.6-BR]  9.78 76.33 0 top
U25  CJT1117B-3.3  [SOT-223-4_L6.5-W3.5-P2.30-LS7.0-BR]  63.88 85.47 180 top
U26  LCKFB-DKX-STM32F103C8T6  [CONN-TH_L53.3-W22.9_STM32F103C8T6-CARD]  72.77 59.18 0 top
U27  HS96L03W2C03  [OLED-TH_L27.8-W27.2-P2.54_C9900033791]  87 85.98 90 top
U28  IR2104STRPBF  [SOIC-8_L4.9-W3.9-P1.27-LS6.0-BL]  34.29 47.24 90 top
U29  IR2104STRPBF  [SOIC-8_L4.9-W3.9-P1.27-LS6.0-BL]  34.54 61.47 90 top
U30  OPA2188AIDR  [SOIC-8_L4.9-W3.9-P1.27-LS6.0-BL]  8 67.44 180 top
U31  ZMPT101B  [XFMR-TH_ZMPT101B]  9.4 44.45 90 top
U34  1mH  [IND-TH_L33.0-W15.6-P15.00-D1.5]  14.99 9.53 180 top
U40  1mH  [IND-TH_L33.0-W15.6-P15.00-D1.5]  40.77 26.67 90 top
U41  220uF  [CAP-TH_BD6.3-P2.50-D0.5-FD]  56.26 42.04 180 top
U42  220uF  [CAP-TH_BD6.3-P2.50-D0.5-FD]  58.55 5.84 270 top

## Footprints (pads in the part's own frame, mm; a bottom-side part is the same pattern mirrored in y, then rotated)
C0805
  rect 1.41x1.35 smd: 1(-1,0) 2(1,0)
C1206
  rect 1.485x1.728 smd: 1(-1.593,0) 2(1.593,0)
CAP-TH_BD6.0-P2.54-D0.5-FD
  round 1.5 hole 0.8: 1(-1.27,0) 2(1.27,0)
CAP-TH_BD6.3-P2.50-D0.5-FD
  round 1.5 hole 0.9: 1(-1.25,0) 2(1.25,0)
CONN-TH_L53.3-W22.9_STM32F103C8T6-CARD
  round 1.6 hole 1: 1(-24.13,-7.62) 2(-21.59,-7.62) 3(-19.05,-7.62) 4(-16.51,-7.62) 5(-13.97,-7.62) 6(-11.43,-7.62) 7(-8.89,-7.62) 8(-6.35,-7.62) 9(-3.81,-7.62) 10(-1.27,-7.62) 11(1.27,-7.62) 12(3.81,-7.62) 13(6.35,-7.62) 14(8.89,-7.62) 15(11.43,-7.62) 16(13.97,-7.62) 17(16.51,-7.62) 18(19.05,-7.62) 19(21.59,-7.62) 20(24.13,-7.62) 21(24.13,7.62) 22(21.59,7.62) 23(19.05,7.62) 24(16.51,7.62) 25(13.97,7.62) 26(11.43,7.62) 27(8.89,7.62) 28(6.35,7.62) 29(3.81,7.62) 30(1.27,7.62) 31(-1.27,7.62) 32(-3.81,7.62) 33(-6.35,7.62) 34(-8.89,7.62) 35(-11.43,7.62) 36(-13.97,7.62) 37(-16.51,7.62) 38(-19.05,7.62) 39(-21.59,7.62) 40(-24.13,7.62)
DC-IN-TH_DC005
  oval 2x4.6 hole 1.2x3.7: 1(3.1,2.35) 2(-3.1,2.35)
  oval 4.6x2 hole 3.7x1.2: 3(0.1,-2.35)
HDR-TH_2P-P2.54-V-F
  rect 1.7x1.7 hole 1: 1(-1.27,0)
  round 1.7 hole 1: 2(1.27,0)
HDR-TH_4P-P2.54-V-F
  rect 1.7x1.7 hole 1.1: 1(-3.81,0)
  round 1.7 hole 1.1: 2(-1.27,0) 3(1.27,0) 4(3.81,0)
IND-SMD_L7.0-W7.0_SMDRS70XX
  rect 2.2x2.4 smd: 1(-3.15,0) 2(3.15,0)
IND-TH_L33.0-W15.6-P15.00-D1.5
  round 2.6 hole 1.8: 1(-7.5,0) 2(7.5,0)
LED0805-R-RD
  rect 1x1.399 smd: 1(1.05,0) 2(-1.05,0)
M3螺丝
  round 3.2 hole 3.2: 1(-0.064,0.064)
OLED-TH_L27.8-W27.2-P2.54_C9900033791
  round 1.8 hole 1.05: 1(-3.81,0) 2(-1.27,0) 3(1.27,0) 4(3.81,0)
R1206
  rect 1.208x1.701 smd: 1(-1.479,0) 2(1.479,0)
RELAY-TH_SRD-XXVDC-XL-C
  round 2.794 hole 1.524: 1(-5.1,-6) 2(7.1,-6) 3(7.1,6) 4(-5.1,6) 5(-7.1,0)
SMA_L4.3-W2.6-LS5.0-FD
  rect 2.046x1.62 smd: 1(-2.304,-0.009) 2(2.304,0.009)
SOD-123_L2.8-W1.8-LS3.7-RD
  rect 0.95x1.15 smd: 1(-1.692,0) 2(1.692,0)
SOIC-8_L4.9-W3.9-P1.27-LS6.0-BL
  oval 0.588x2.045 smd: 1(-1.905,-2.772) 2(-0.635,-2.772) 3(0.635,-2.772) 4(1.905,-2.772) 5(1.905,2.772) 6(0.635,2.772) 7(-0.635,2.772) 8(-1.905,2.772)
SOIC-8_L4.9-W3.9-P1.27-LS6.0-BL-EP3.1-1
  oval 0.63x1.865 smd: 1(-1.905,-2.683) 2(-0.635,-2.683) 3(0.635,-2.683) 4(1.905,-2.683) 5(1.905,2.683) 6(0.635,2.683) 7(-0.635,2.683) 8(-1.905,2.683)
  rect 3.1x2.3 smd: 9(0,0)
SOT-23-3_L2.9-W1.3-P1.90-LS2.4-BR
  rect 1.25x0.7 smd: 1(1,-0.95) 2(1,0.95) 3(-1,0)
SOT-23-3_L2.9-W1.4-P1.90-LS2.6-BR
  rect 0.91x0.6 smd: 1(1.055,-0.955) 2(1.055,0.955) 3(-1.055,0)
SOT-223-4_L6.5-W3.5-P2.30-LS7.0-BR
  rect 2.47x0.98 smd: 1(2.835,-2.3) 2(2.835,0) 3(2.835,2.3)
  rect 2.47x3.6 smd: 4(-2.835,0)
SW-TH_4P-L6.0-W6.0-P4.50-LS6.5
  round 1.8 hole 1.2: 1(-3.25,2.25) 2(3.25,2.25) 3(-3.25,-2.25) 4(3.25,-2.25)
SW-TH_6P-L8.0-W8.0-P2.50
  rect 1.524x1.524 hole 1: 1(-2.5,-3)
  round 1.524 hole 1: 2(0,-3) 3(2.5,-3) 4(-2.5,3) 5(0,3) 6(2.5,3)
TO-220-3_L10.0-W4.5-P2.54-T
  rect 2.5x2 hole 1.3: 1(0,2.54)
  oval 2.5x2 hole 1.3: 2(0,0) 3(0,-2.54)
XFMR-TH_ZMPT101B
  round 2 hole 1.2: 1(-5,6.35) 2(-5,-6.35) 3(5,-6.35) 4(5,6.35)

## Nets
As in the schematic.

Pads without a net: RLY1 3; SW1 1 2 3 4; TP1 1; TP2 1; TP3 1; TP4 1; U1 2; U26 1 3 4 7 8 9 10 11 12 13 14 15 18 20 21 22 23 24 26 27 28 29 30 31 32 35 36 37

## Via types
v1: diameter 0.61, hole 0.305, Top Layer to Bottom Layer, 245 vias

## Routing (per net, layer and track width the routed paths; a pad name or vN(x,y) marks a point on that pad's centre or on a via; arc(x,y) is an arc through that point)
+3.3V: length 44.2
  Top Layer w0.254: U27.2 86.85,84.57 C13.2 81.42,84.57 79.61,86.38 69.72,86.38
  Top Layer w0.762: C11.1 64.52,77.34 55.12,77.34 53.72,75.95 U26.38
+5V:
  vias: v1(10.31,66.29) v1(10.54,63.37) v1(11.6,66.29) v1(11.7,63.37) v1(12.84,63.37) v1(12.86,66.29) v1(14.1,63.37) v1(17.14,76.71) v1(17.14,75.75) v1(18.29,76.71) v1(18.29,75.72) v1(49.91,90.42) v1(49.91,89.41) v1(49.91,88.3) v1(49.97,92.79) v1(49.97,91.78) v1(51.44,90.42) v1(51.44,89.36) v1(51.44,88.25) v1(51.5,92.79) v1(51.5,91.72) v1(53.15,92.79) v1(53.15,91.64) v1(53.09,90.42) v1(53.09,89.28) v1(53.09,88.27) v1(54.93,92.79) v1(54.93,91.62) v1(54.86,90.42) v1(54.86,89.26) v1(54.86,88.16) v1(76.58,40) v1(76.58,38.99) v1(77.74,38.99) v1(77.75,40) v1(90.04,30.48) v1(90.04,29.68)
+12V:
  vias: v1(25.91,89.28) v1(25.91,88.27) v1(26.85,89.28) v1(26.85,88.27) v1(27.9,89.28) v1(27.92,88.27) v1(36.34,58.67) v1(36.32,55.5) v1(36.72,43.92) v1(36.7,40.75) v1(37.63,58.67) v1(37.59,55.5) v1(38.01,43.92) v1(37.97,40.75) v1(38.1,57.69) v1(38.1,56.64) v1(38.48,42.94) v1(38.48,41.89)
AGND:
  vias: v1(26.42,66.04) v1(26.42,64.9) v1(26.42,51.18) v1(26.42,50.17) v1(26.42,39.5) v1(26.42,14.1) v1(26.42,3.94) v1(30.99,52.32) v1(31.5,39.5) v1(34.54,65.91) v1(41.66,39.5) v1(41.66,14.1) v1(41.78,56.77) v1(41.78,52.2) v1(41.91,42.8) v1(46.74,39.5) v1(46.74,14.1) v1(51.82,39.5) v1(51.82,3.94) v1(56.9,3.94) v1(61.98,39.5) v1(61.98,29.34) v1(61.98,14.1) v1(61.98,9.02) v1(61.98,3.94) v1(67.06,39.5) v1(67.06,24.26) v1(67.06,14.1) v1(72.14,29.34) v1(72.14,24.26) v1(72.14,14.1) v1(77.22,14.1) v1(82.3,14.1) v1(87.38,14.1) v1(92.46,24.26) v1(92.46,19.18) v1(92.46,14.1) v1(97.54,19.18) v1(97.54,14.1)
GND: length 4.8
  Top Layer w0.584: U28.4 34.84,49.15 v1(34.8,49.11) ; U29.4 v1(34.8,63.37)
  vias: v1(3.73,98.12) v1(3.73,93.04) v1(3.73,87.96) v1(3.73,82.88) v1(3.73,77.8) v1(3.73,72.72) v1(3.73,57.48) v1(3.73,47.32) v1(3.73,42.24) v1(3.73,1.6) v1(8.81,98.12) v1(8.81,93.04) v1(8.81,82.88) v1(8.81,77.8) v1(8.81,57.48) v1(8.81,47.32) v1(8.81,42.24) v1(8.81,37.16) v1(8.81,21.92) v1(8.81,6.68) v1(8.81,1.6) v1(13.89,98.12) v1(13.89,93.04) v1(13.89,57.48) v1(13.89,52.4) v1(13.89,47.32) v1(13.89,42.24) v1(13.89,37.16) v1(13.89,21.92) v1(13.89,16.84) v1(13.89,11.76) v1(13.89,6.68) v1(13.89,1.6) v1(18.97,98.12) v1(18.97,93.04) v1(18.97,72.72) v1(18.97,67.64) v1(18.97,57.48) v1(18.97,52.4) v1(18.97,47.32) v1(18.97,42.24) v1(18.97,21.92) v1(18.97,16.84) v1(18.97,11.76) v1(18.97,6.68) v1(18.97,1.6) v1(24.05,98.12) v1(24.05,93.04) v1(24.05,77.8) v1(24.05,72.72) v1(29.13,98.12) v1(29.13,82.88) v1(29.13,77.8) v1(29.13,72.72) v1(34.21,98.12) v1(34.21,77.8) v1(34.21,72.72) v1(39.29,98.12) v1(39.68,72.72) v1(44.37,98.12) v1(44.37,87.96) v1(44.37,77.8) v1(44.37,72.72) v1(49.45,98.12) v1(49.45,77.8) v1(49.45,72.72) v1(54.53,98.12) v1(59.61,98.12) v1(59.61,93.04) v1(59.61,72.72) v1(64.69,98.12) v1(64.69,93.04) v1(64.69,72.72) v1(64.69,62.56) v1(64.69,57.48) v1(64.69,11.76) v1(64.69,1.6) v1(69.77,98.12) v1(69.77,93.04) v1(69.77,77.8) v1(69.77,72.72) v1(69.77,62.56) v1(69.77,57.48) v1(69.77,11.76) v1(69.77,1.6) v1(74.85,98.12) v1(74.85,72.72) v1(74.85,62.56) v1(74.85,57.48) v1(74.85,42.24) v1(74.85,11.76) v1(79.93,98.12) v1(79.93,93.04) v1(79.93,87.96) v1(79.93,82.88) v1(79.93,77.8) v1(79.93,72.72) v1(79.93,62.56) v1(79.93,57.48) v1(79.93,37.16) v1(79.93,32.08) v1(79.93,11.76) v1(85.01,98.12) v1(85.01,93.04) v1(85.01,87.96) v1(85.01,77.8) v1(85.01,72.72) v1(85.01,62.56) v1(85.01,57.48) v1(85.01,42.24) v1(85.01,21.92) v1(85.01,11.76) v1(85.01,1.6) v1(90.09,98.12) v1(90.09,93.04) v1(90.09,87.96) v1(90.09,82.88) v1(90.09,77.8) v1(90.09,72.72) v1(90.09,62.56) v1(90.09,57.48) v1(90.09,27) v1(90.09,21.92) v1(90.09,11.76) v1(90.09,1.6) v1(95.17,98.12) v1(95.17,87.96) v1(95.17,82.88) v1(95.17,52.4) v1(95.17,27) v1(95.17,11.76) v1(95.17,1.6)
VCC:
  vias: v1(51.94,8.51) v1(51.94,7.62) v1(51.94,6.65) v1(55.88,8.51) v1(55.88,7.58) v1(55.88,6.6) v1(57.27,34.92) v1(57.27,33.43) v1(58.42,34.92) v1(58.43,33.43) v1(59.66,34.87) v1(59.66,33.43)
ADC: length 71.4
  Top Layer w0.254: H9.1 19.81,67.31 44.32,67.31 47.37,64.26 84.2,64.26 U26.25
HO1: length 12.9
  Top Layer w0.508: D7.1 41.89,9.79 R26.1 42.11,4.26 40.77,2.92 H7.1
HO2: length 5.6
  Top Layer w0.508: 72.14,31.24 71.75,31.62 69.12,31.62 R30.1 ; 69.54,29.3 69.16,29.68 69.16,31.5
KEY: length 40
  Top Layer w0.254: v1(75.56,87.38) 75.56,89.11 SW2.1 SW2.2 ; v1(75.56,85.6) 75.56,76.45 74.8,75.69 64.52,75.69 63.88,75.06 U26.34
  Bottom Layer w0.254: v1(75.56,87.38) v1(75.56,85.6)
LO1: length 8.6
  Top Layer w0.508: 29.64,10.29 29.64,7.83 29.55,7.75 29.59,7.71 29.59,5.84 H7.3
LO2: length 18.7
  Top Layer w0.508: D10.1 68.46,22.01 R32.1 68.58,24.51 70.49,24.51 73.91,27.94 73.91,34.37 72.14,36.15 72.14,36.32
PROTECT: length 50.5
  Top Layer w0.254: 77.53,24.27 76.7,24.27 74.8,26.16 74.8,40.51 v1(72.77,42.55) ; v1(66.42,63.25) 66.42,59.44 67.18,58.67 72.14,58.67 72.77,58.04 v1(72.77,48.64)
  Bottom Layer w0.254: U26.33 v1(66.42,63.25) ; v1(72.77,48.64) v1(72.77,42.55)
PWM: length 18.1
  Top Layer w0.254: R13.1 53.25,45.85 58.8,51.39 U26.5
PWM_N: length 15.7
  Top Layer w0.254: R15.1 50.67,59.56 51.18,59.06 U26.2
PWM_SD: length 51.2
  Top Layer w0.254: R16.1 60.32,63.37 61.47,62.23 61.47,51.69 U26.6 61.34,51.69 60.2,52.83 55.5,52.83 54.99,52.32 54.99,49.78 54.62,49.41 R14.1
SCL: length 41
  Top Layer w0.254: U26.16 87,51.56 93.09,57.66 93.09,81.15 U27.3
SDA: length 44.4
  Top Layer w0.254: U27.4 95.63,81.15 95.63,58.04 89.28,51.69 U26.17
$1N1140: length 3.6
  Top Layer w0.254: R3.2 30.42,89.14 30.42,88.58 31.24,87.76 31.99,87.76 U1.6
$1N1147: length 5.5
  Top Layer w0.254: C5.2 36.4,91.69 36.35,91.64 36.35,87.87 36.85,87.38 37.48,87.38 U1.3
$1N1148: length 2.5
  Top Layer w0.254: C5.1 R4.2
$1N1149: length 8.4
  Top Layer w0.254: R5.2 R6.1 39.41,93.39 38.48,92.46 38.48,89.65 U1.4
$1N3535: length 4.9
  Bottom Layer w0.508: D3.2 83.06,30.1 82.28,29.32 RLY1.4
$1N3675: length 3.2
  Top Layer w0.254: 77.13,34.5 LED1.1
$1N4743: length 3.4
  Top Layer w0.584: R13.2 39.41,46.61 U28.2
$1N4782: length 3.8
  Top Layer w0.584: R14.2 38.69,47.88 U28.3
$1N5050: length 8.1
  Top Layer w0.254: U28.6 31.33,47.69 C14.2 27.25,47.69 24.89,45.34 H5.2
$1N5056: length 9.5
  Top Layer w0.254: H5.1 25.02,42.42 26.29,43.69 26.29,45.59 27.18,46.48 31.39,46.48 U28.7
$1N5061: length 7.3
  Top Layer w0.254: U28.5 26.8,49.15 25.15,47.5 H5.3
$1N5482: length 3.4
  Top Layer w0.584: U29.2 38.91,60.83 R15.2
$1N5484: length 3.4
  Top Layer w0.584: R16.2 38.91,62.1 U29.3
$1N5486: length 7.4
  Top Layer w0.254: H6.2 25.72,61.66 28.32,61.66 C15.2 28.76,62.1 U29.6
$1N5489: length 8.1
  Top Layer w0.254: H6.1 24.89,58.55 27.05,60.71 31.64,60.71 U29.7
$1N5491: length 6.9
  Top Layer w0.254: H6.3 U29.5
$1N7713: length 6.6
  Top Layer w0.254: U30.6 7.37,62.31 R19.2 9.91,59.52 R20.2
$1N7818: length 12.3
  Top Layer w0.254: H9.2 20.83,65.02 17.42,61.61 C18.2 17.65,61.23 17.65,59.56 17.02,58.93 D6.1 ; R21.2 17.38,61.59
$1N7823: length 5.6
  Top Layer w0.254: U30.7 8.76,64.54 8.76,63.63 9.91,62.48 R20.1 11.65,62.19 R21.1
$1N8226: length 13.7
  Top Layer w0.254: U31.3 11,49.45 4.91,55.54 R24.2
$1N8230: length 10.1
  Top Layer w0.254: U31.4 3.05,54.78 R24.1 1.91,55.92 R22.2
$1N9075: length 9.2
  Top Layer w0.508: D7.2 45.28,9.79 45.19,9.7 ; 45.19,9.7 R26.2 45.36,9.28 R25.1 ; 45.19,9.7 Q2.1
$1N9356: length 9.2
  Top Layer w0.508: 32.64,9.65 32.64,8.04 32.93,7.75 36.68,7.75 Q3.1 ; 32.39,10.92 32.39,13.8 R27.1
$1N9734: length 8.9
  Top Layer w0.508: R29.1 66.12,33.88 R30.2 62.01,31.58 Q4.1 ; 66.16,29.3 66.16,31.54
$1N9747: length 9.6
  Top Layer w0.508: R31.1 65.03,20.01 D10.2 65.03,24.17 62.02,24.17 61.1,23.25 Q5.1
$1N10759: length 5.6
  Top Layer w0.762: H12.1 H12.2 R34.1
$1N10764: length 3.1
  Top Layer w0.762: R34.2 L2.1
$1N10806: length 10.4
  Top Layer w0.762: H13.2 H13.1 89.22,8.07 C22.1 84.89,8 L2.2
$1N16706: length 5.6
  Top Layer w0.508: U31.2 16.38,38.82 R23.1

## Copper pours and planes (outline as drawn; the poured copper is in the pictures)
+3.3V on Top Layer: 59.44,87.46 74.99,87.46 74.99,80.05 59.44,80.05
+5V on Top Layer: 75.82,40.51 78.36,40.51 78.36,36.58 75.82,36.58
+5V on Top Layer: 41.4,95 62.84,95 62.84,82.17 41.4,82.17
+5V on Top Layer: 9.4,66.67 15.62,66.67 15.62,62.99 9.4,62.99
+5V on Top Layer: 14.73,77.72 18.8,77.72 18.8,74.93 14.73,74.93
+5V on Bottom Layer: 88.32,30.97 90.44,30.97 90.44,29.23 88.32,29.23
+5V on Inner2: 0.26,99.74 99.74,99.74 99.74,0.26 0.26,0.26
+12V on Top Layer: 20.46,87.5 33.27,87.5 33.27,81.92 20.46,81.92
+12V on Top Layer: 35.43,60.07 38.74,60.07 38.74,54.99 35.43,54.99
+12V on Top Layer: 25.46,89.79 28.65,89.79 28.65,85.6 25.46,85.6
+12V on Top Layer: 35.56,45.85 38.86,45.85 38.86,40 35.56,40
+12V on Bottom Layer: 25.4,89.8 38.86,89.8 38.86,39.24 25.4,39.24
AGND on Top Layer: 23.24,68.33 44.7,68.33 44.7,44.7 73.79,44.7 73.79,19.05 91.19,19.05 91.19,26.16 99.82,26.16 99.82,12.57 62.87,12.57 62.87,0.38 23.24,0.38 23.24,68.32
AGND on Bottom Layer: 23.24,66.67 23.24,0.25 23.11,0.13 62.61,0.13 62.61,12.45 99.31,12.45 99.44,12.32 99.44,25.78 91.19,25.78 91.06,25.91 91.06,18.8 91.19,18.67 73.66,18.67 73.53,18.8 73.53,43.31 56.13,43.31 56.13,44.41 44.58,44.41 44.58,66.67 44.58,66.67
AGND on Bottom Layer: 23.24,0.44 23.24,66.93 44.53,66.93 44.58,66.89 44.58,44.7 56.13,44.7 56.26,44.58 56.26,43.66 73.62,43.66 73.62,20.28 73.03,19.69 73.53,19.18 73.53,18.92 73.62,19.01 73.62,18.96 73.66,18.92 90.93,18.92 91.06,19.05 91.06,26.03 99.44,26.03 99.57,25.91 99.57,13.08 99.31,12.83 63.12,12.83 62.99,12.7 62.99,0.51 62.87,0.38 23.18,0.38
GND on Top Layer: -5.59,102.49 100.33,102.49 100.33,-1.14 -5.59,-1.14
GND on Top Layer: -4.32,104.52 109.09,104.52 109.09,-8.89 -4.32,-8.89
GND on Bottom Layer: -0.76,101.35 101.47,101.35 101.47,-1.27 -0.76,-1.27
GND on Inner1: 0.26,99.74 99.74,99.74 99.74,0.26 0.26,0.26
VCC on Top Layer: 56.64,47.5 95.42,47.5 95.42,32.96 56.64,32.96
VCC on Top Layer: 51.44,9.14 56.51,9.14 56.51,6.1 51.44,6.1
VCC on Bottom Layer: 47.65,35.43 60.2,35.43 60.2,6.1 47.65,6.1
VIN on Top Layer: 12.83,89.03 20.19,89.03 20.19,81.92 12.83,81.92
AC+ on Top Layer: 1.02,40.91 10.16,40.91 10.16,7.49 1.02,7.49
AC- on Top Layer: 9.4,37.34 43.18,37.34 43.18,26.29 9.4,26.29
VREF on Top Layer: 5.2,76.45 8.25,76.45 8.25,69.09 5.2,69.09
VS1 on Top Layer: 33.78,5.84 51.05,5.84 51.05,0.38 33.78,0.38
VS1 on Bottom Layer: 20.44,11.94 38.74,11.94 38.74,7.75 20.44,7.75
VS1 on Bottom Layer: 32.79,11.94 38.75,11.94 38.75,1.48 32.79,1.48
VS2 on Top Layer: 37.85,21.59 62.61,21.59 62.61,17.53 37.85,17.53
VS2 on Top Layer: 60.32,38.35 72.71,38.35 72.71,32.71 60.32,32.71
VS2 on Bottom Layer: 59.34,34.92 75.31,34.92 75.31,19.04 59.34,19.04
$1N1144 on Top Layer: 31.13,85.34 35.05,85.34 35.05,81.92 31.13,81.92
$1N1145 on Top Layer: 35.43,90.04 41.82,90.04 41.82,81.93 35.43,81.93
$1N3535 on Top Layer: 75.82,30.88 83.82,30.88 83.82,23.1 75.82,23.1
$1N3825 on Top Layer: 76.24,22.73 83.06,22.73 83.06,20.19 76.24,20.19
$1N3941 on Top Layer: 85.34,37.3 99.03,37.3 99.03,25.72 85.34,25.72
$1N5066 on Top Layer: 27.31,45.72 33.66,45.72 33.66,41.28 27.31,41.28
$1N5493 on Top Layer: 27.31,60.07 33.53,60.07 33.53,55.5 27.31,55.5
$1N7479 on Top Layer: 2.79,71.42 10.53,71.42 10.53,67.18 2.79,67.18
$1N8024 on Top Layer: 0.64,66.04 6.73,66.04 6.73,61.21 0.64,61.21
$1N11007 on Top Layer: 9.78,77.72 13.59,77.72 13.59,72.21 9.78,72.21

Small or netless copper shapes (teardrops, artwork), in the pictures only: 1 on Top Layer, 68 on Inner1, 12 on Inner2

## Text on the board
Top Silkscreen Layer: GND | ADC | H2 | H1 | 5V | IN | 3.3V | OUT | VIN
